# EAGLE design PFC_Method_V1.1 (EAGLE 9.3.0)
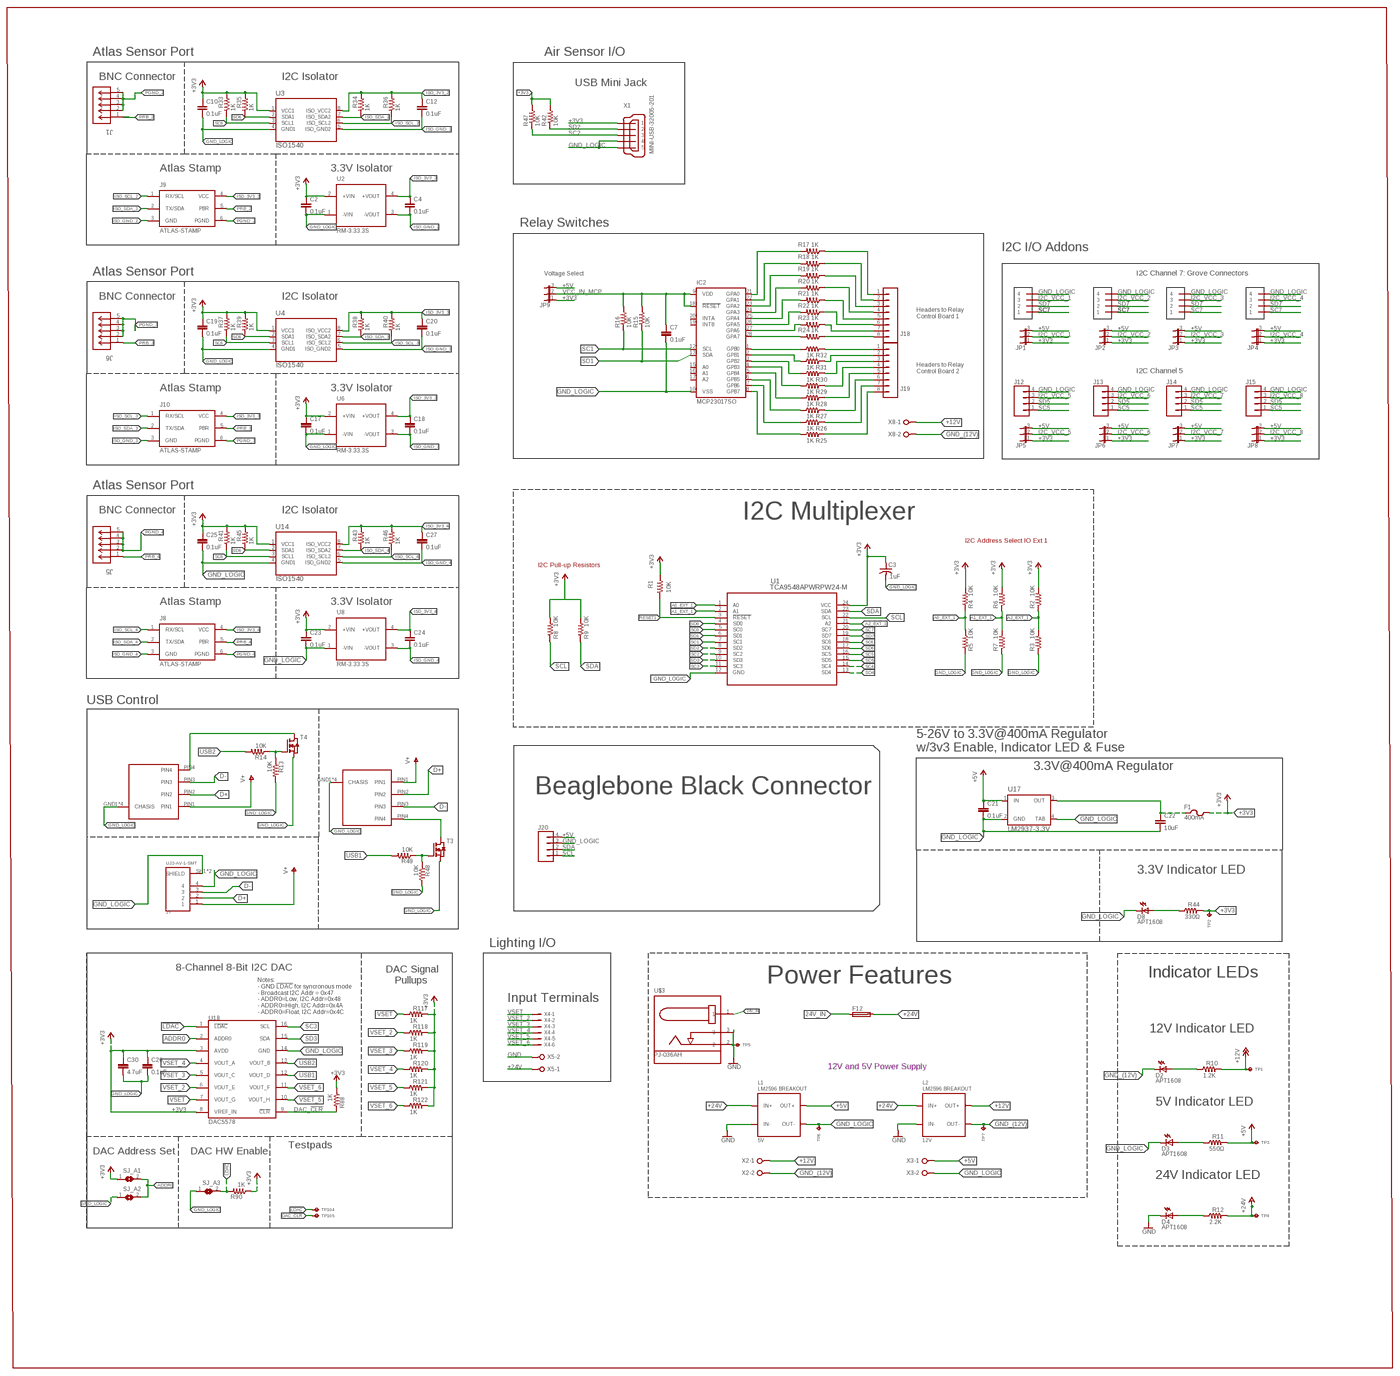
[diagram p0: schematic, sheet 1, overview]
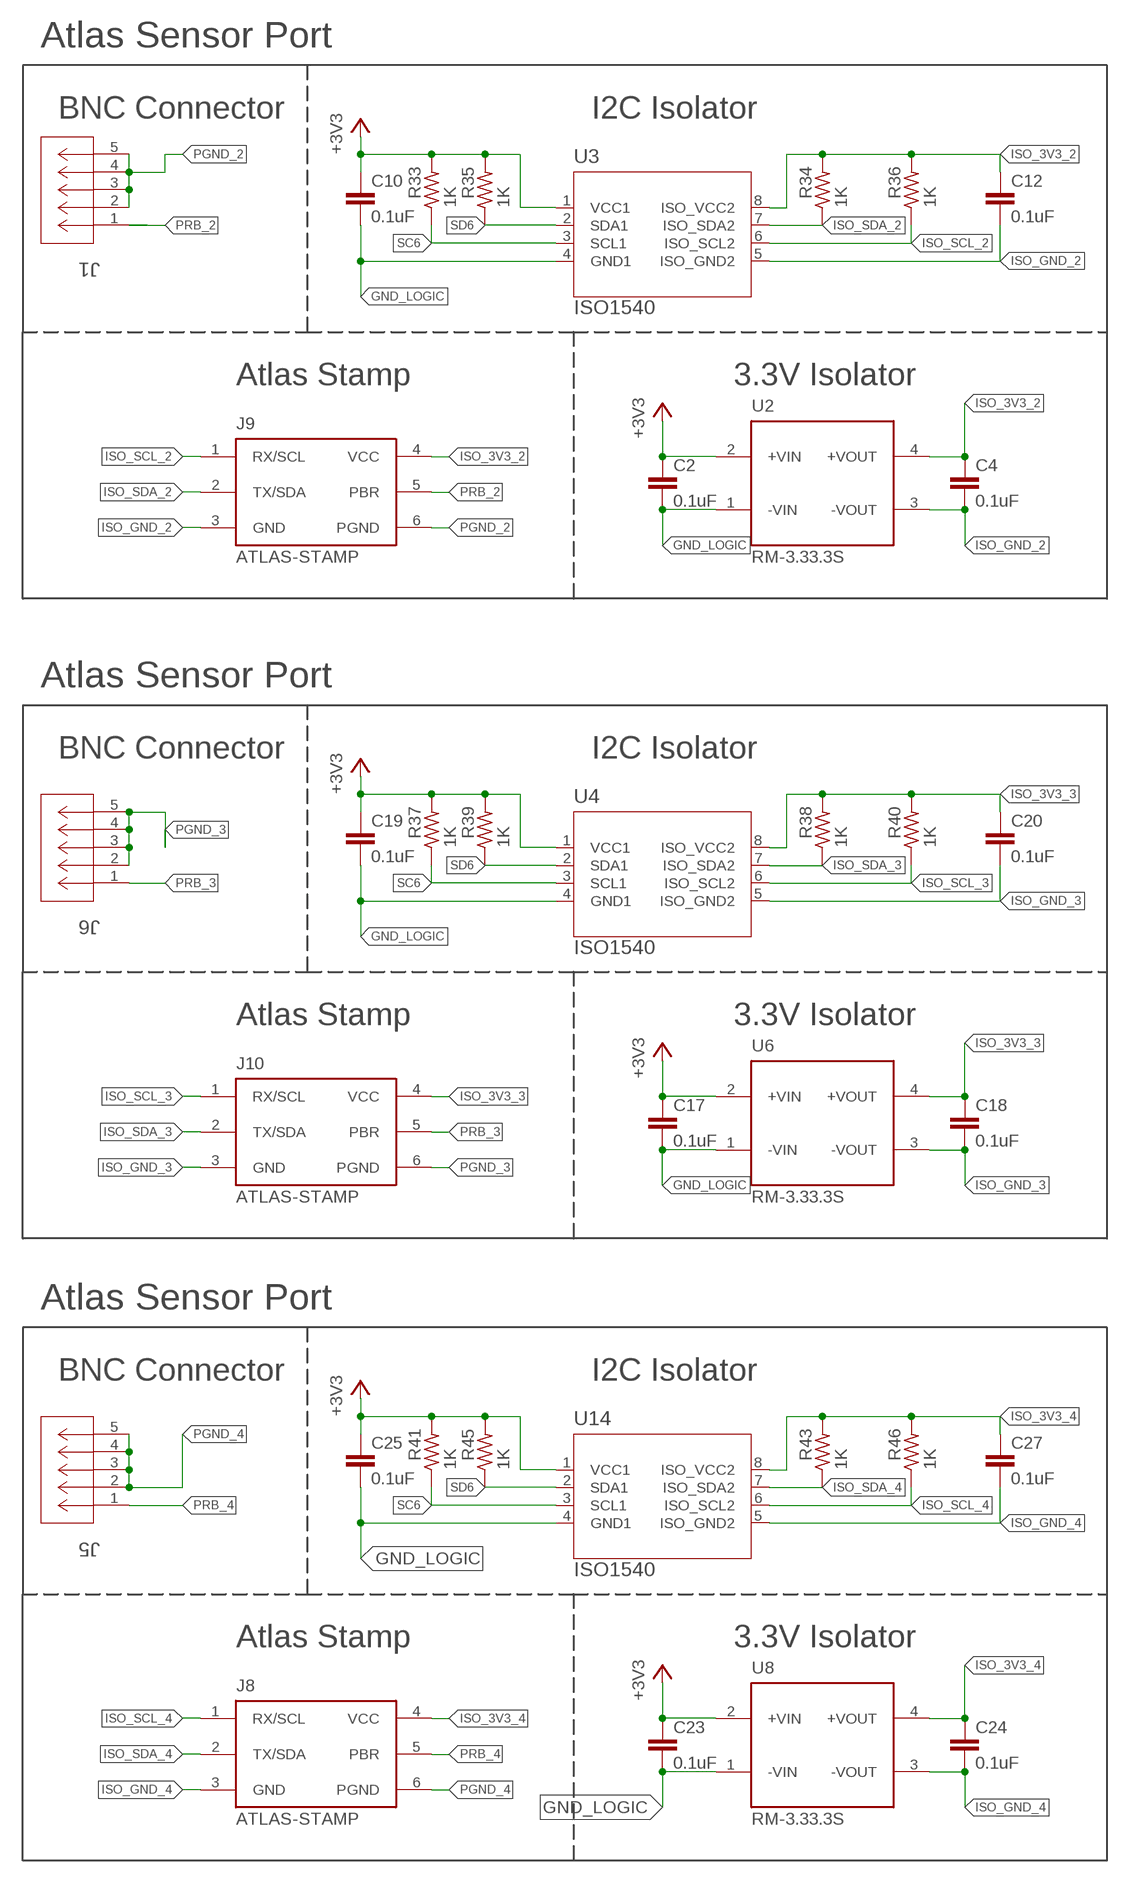
[diagram p1: schematic, sheet 1, part 1 of 4]
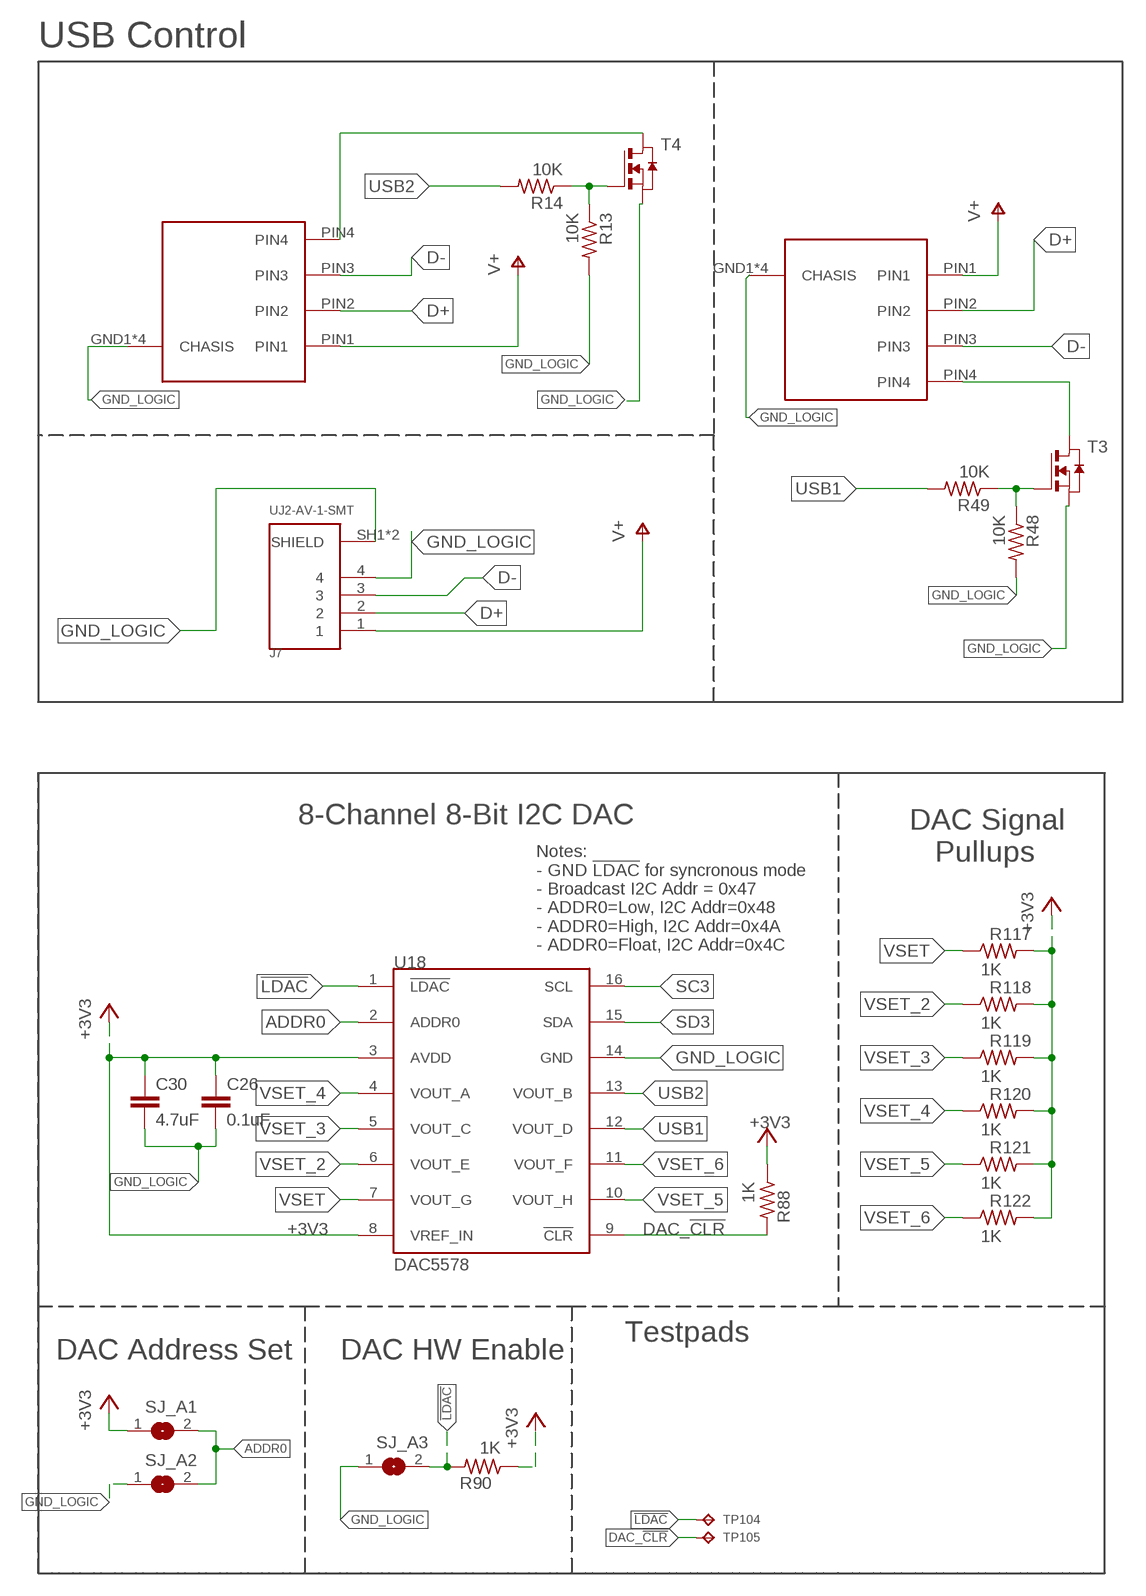
[diagram p2: schematic, sheet 1, part 2 of 4]
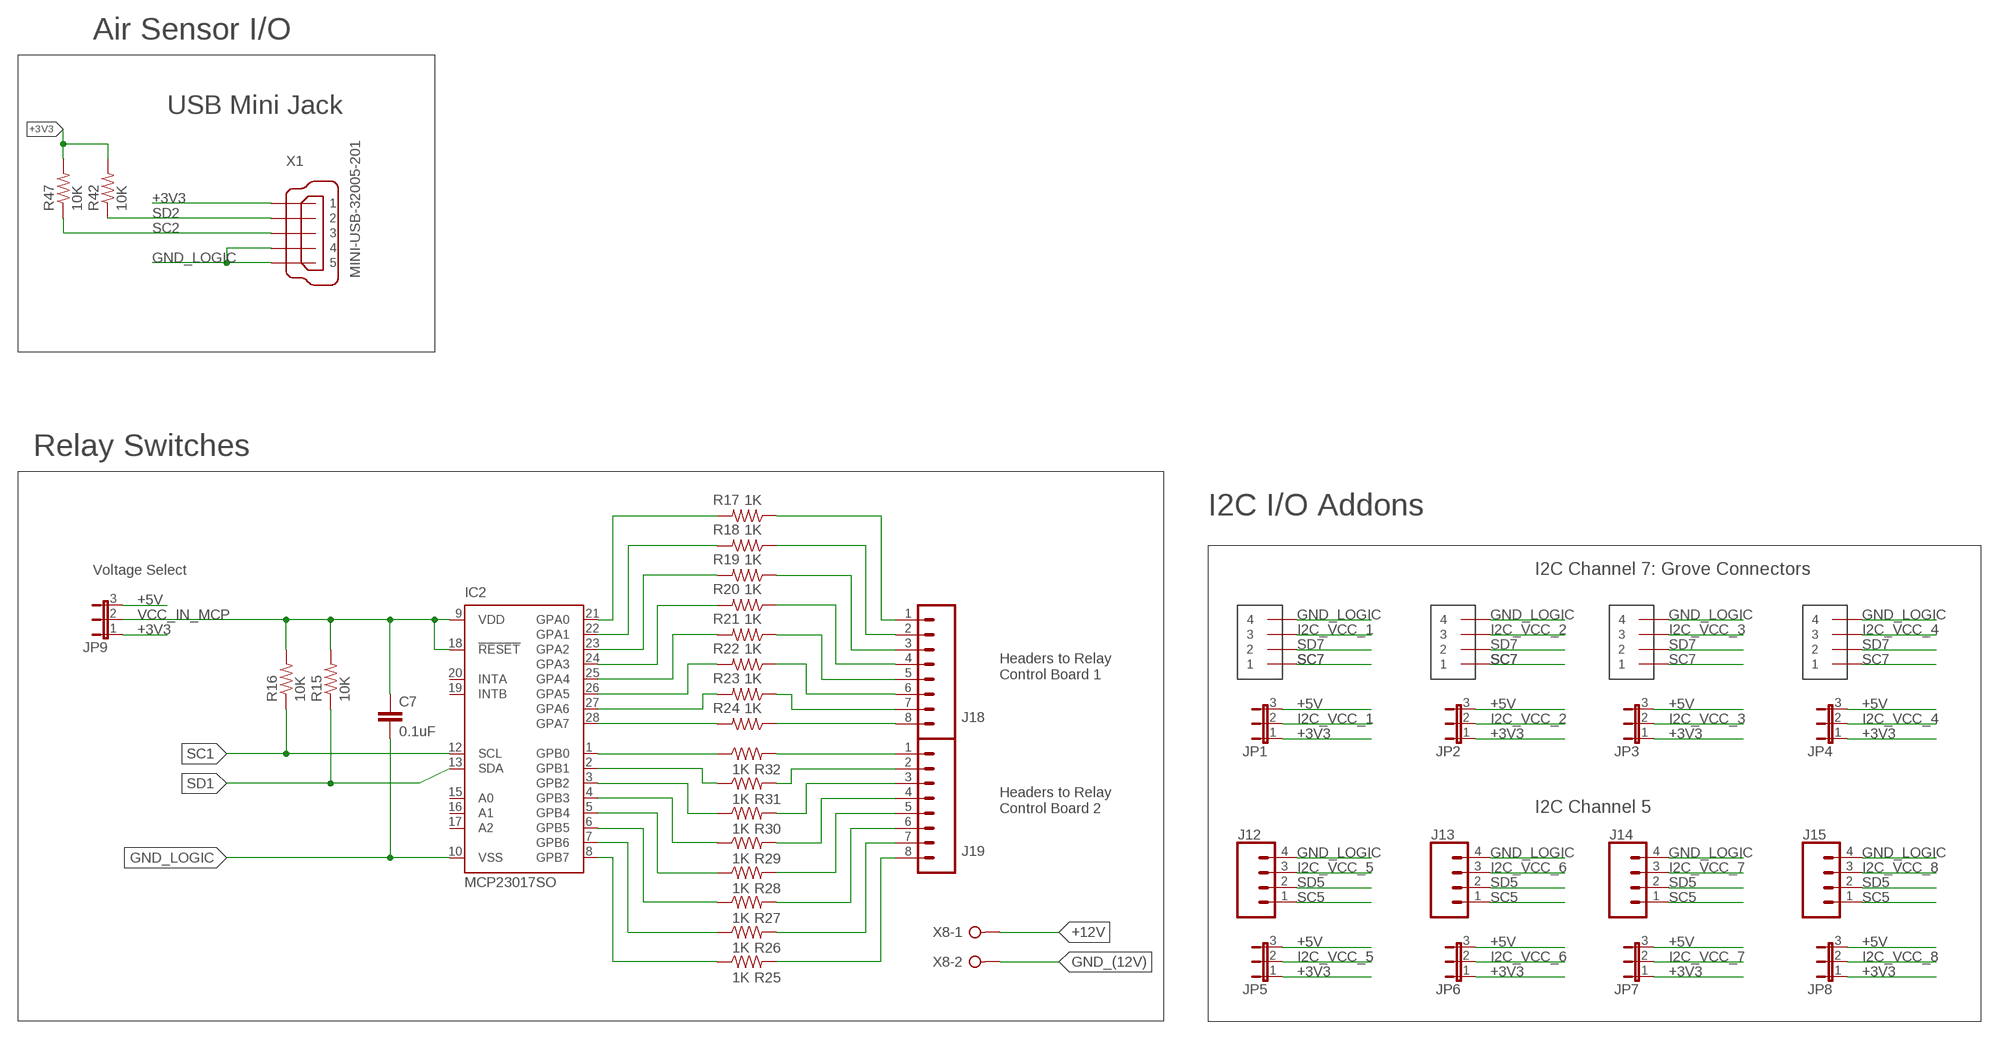
[diagram p3: schematic, sheet 1, part 3 of 4]
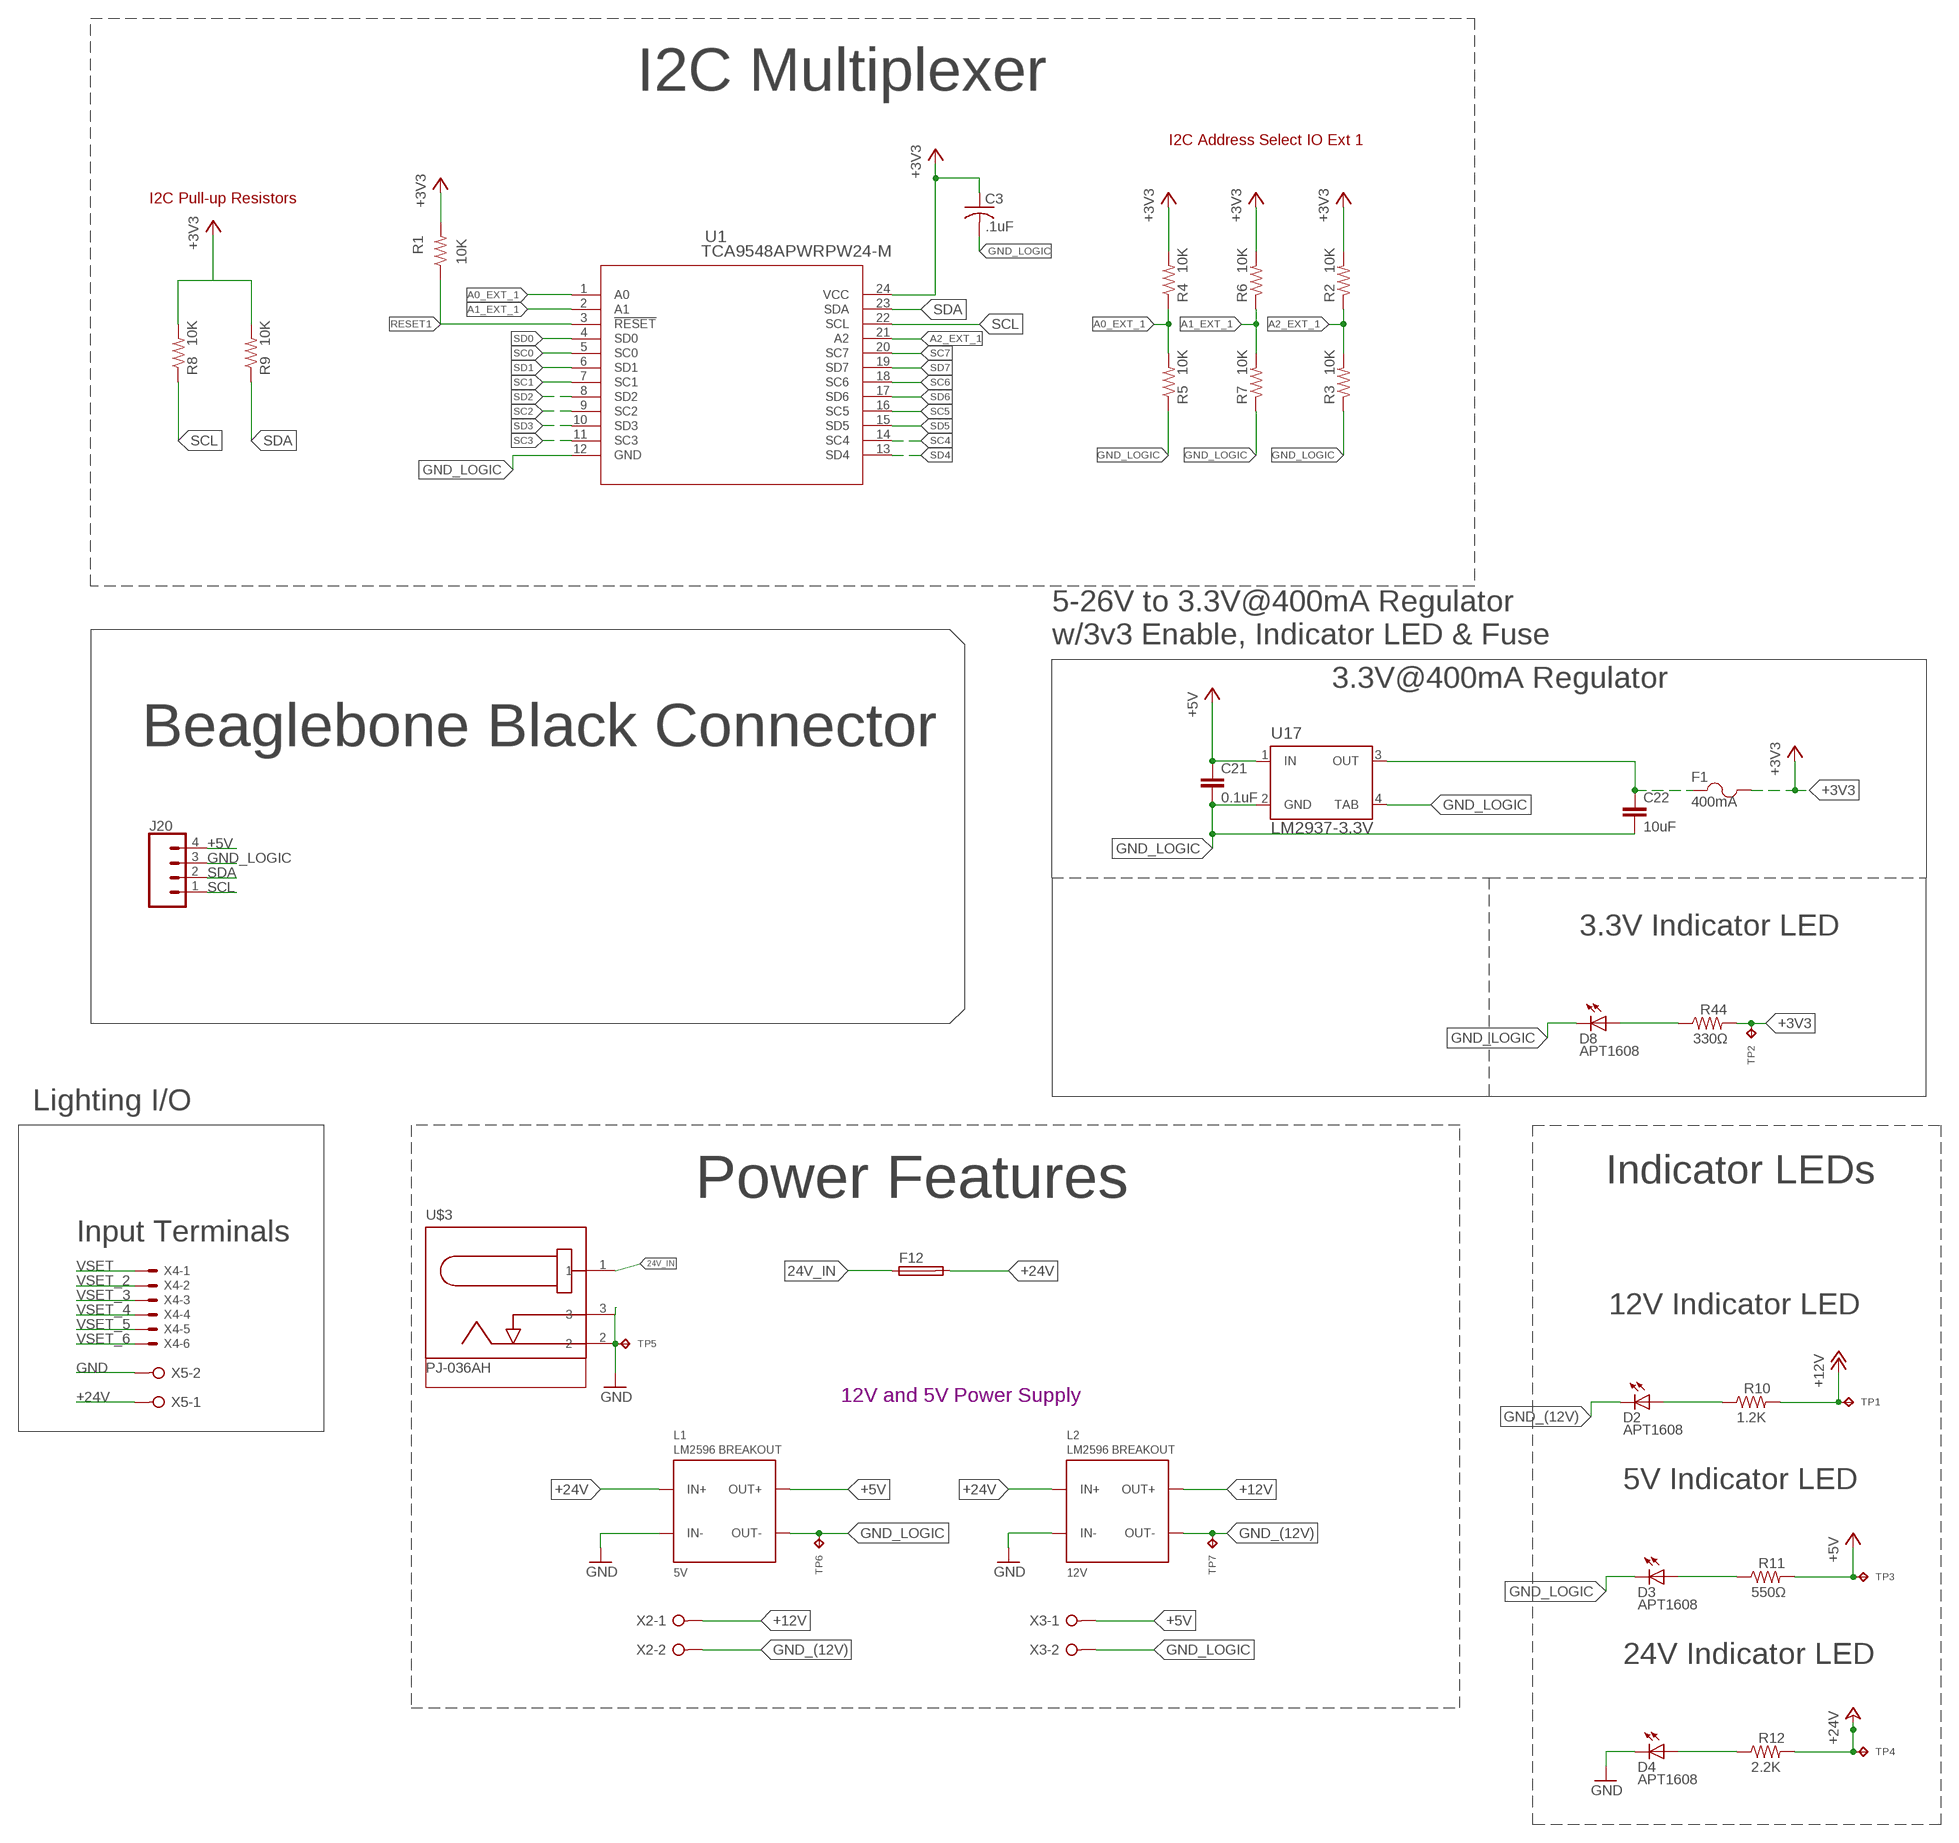
[diagram p4: schematic, sheet 1, part 4 of 4]

## Parts
C2  0.1uF  0.1UF-C0603C104K5RACTU  [C0603]
C3  .1uF  C-USC0603  [C0603@1]
C4  0.1uF  0.1UF-C0603C104K5RACTU  [C0603]
C7  0.1uF  0.1UF-C0603C104K5RACTU  [C0603]
C10  0.1uF  0.1UF-C0603C104K5RACTU  [C0603]
C12  0.1uF  0.1UF-C0603C104K5RACTU  [C0603]
C17  0.1uF  0.1UF-C0603C104K5RACTU  [C0603]
C18  0.1uF  0.1UF-C0603C104K5RACTU  [C0603]
C19  0.1uF  0.1UF-C0603C104K5RACTU  [C0603]
C20  0.1uF  0.1UF-C0603C104K5RACTU  [C0603]
C21  0.1uF  0.1UF-C0603C104K5RACTU  [C0603]
C22  10uF  10UF-GMK212BBJ106KG-T  [C0805]
C23  0.1uF  0.1UF-C0603C104K5RACTU  [C0603]
C24  0.1uF  0.1UF-C0603C104K5RACTU  [C0603]
C25  0.1uF  0.1UF-C0603C104K5RACTU  [C0603]
C26  0.1uF  0.1UF-C0603C104K5RACTU  [C0603]
C27  0.1uF  0.1UF-C0603C104K5RACTU  [C0603]
C30  4.7uF  4.7UF-CL21A475KBQNNNE  [C0805]
D2  APT1608  APT1608CGCK  [CHIPLED_0603]
D3  APT1608  APT1608CGCK  [CHIPLED_0603]
D4  APT1608  APT1608CGCK  [CHIPLED_0603]
D8  APT1608  APT1608CGCK  [CHIPLED_0603]
F1  400mA  0438.375WR  [0603]
F12  GSH15  [GSH15]
IC2  MCP23017SO  [SO28W]
J1  5-1634503-1  [CONN5_5-1634503-1]
J2  GROVE_4PIN_CONNECTOR  [GROVE_4PIN_CONNECTOR]
J3  GROVE_4PIN_CONNECTOR  [GROVE_4PIN_CONNECTOR]
J5  5-1634503-1  [CONN5_5-1634503-1]
J6  5-1634503-1  [CONN5_5-1634503-1]
J7  UJ2-AV-1-SMT  [CUI_UJ2-AV-1-SMT]
J8  ATLAS-STAMP  [ATLAS-STAMP]
J9  ATLAS-STAMP  [ATLAS-STAMP]
J10  ATLAS-STAMP  [ATLAS-STAMP]
J12  CONN_04  [1X04]
J13  CONN_04  [1X04]
J14  CONN_04  [1X04]
J15  CONN_04  [1X04]
J16  GROVE_4PIN_CONNECTOR  [GROVE_4PIN_CONNECTOR]
J17  GROVE_4PIN_CONNECTOR  [GROVE_4PIN_CONNECTOR]
J18  CONN_08"  [1X08]
J19  CONN_08"  [1X08]
J20  CONN_04  [1X04]
JP1  JP2E  [JP2]
JP2  JP2E  [JP2]
JP3  JP2E  [JP2]
JP4  JP2E  [JP2]
JP5  JP2E  [JP2]
JP6  JP2E  [JP2]
JP7  JP2E  [JP2]
JP8  JP2E  [JP2]
JP9  JP2E  [JP2]
L1  5V  LM2596_BREAKOUT  [LM2596]
L2  12V  LM2596_BREAKOUT  [LM2596]
R1  10K  R-US_R0603  [R0603]
R2  10K  10KOHM-1/10W-1%(0603)0603  [0603-RES]
R3  10K  10KOHM-1/10W-1%(0603)0603  [0603-RES]
R4  10K  10KOHM-1/10W-1%(0603)0603  [0603-RES]
R5  10K  10KOHM-1/10W-1%(0603)0603  [0603-RES]
R6  10K  10KOHM-1/10W-1%(0603)0603  [0603-RES]
R7  10K  10KOHM-1/10W-1%(0603)0603  [0603-RES]
R8  10K  10KOHM-1/10W-1%(0603)0603  [0603-RES]
R9  10K  10KOHM-1/10W-1%(0603)0603  [0603-RES]
R10  1.2K  100OHM-RC0603JR-07100RL  [RC0603N]
R11  550Ω  100OHM-RC0603JR-07100RL  [RC0603N]
R12  2.2K  100OHM-RC0603JR-07100RL  [RC0603N]
R13  10K  R-US_R0805W  [R0805W]
R14  10K  R-US_R0805W  [R0805W]
R15  10K  R-US_R0603  [R0603]
R16  10K  R-US_R0603  [R0603]
R17  1K  1K-ERJ-PB3D1001V  [RC0603N]
R18  1K  1K-ERJ-PB3D1001V  [RC0603N]
R19  1K  1K-ERJ-PB3D1001V  [RC0603N]
R20  1K  1K-ERJ-PB3D1001V  [RC0603N]
R21  1K  1K-ERJ-PB3D1001V  [RC0603N]
R22  1K  1K-ERJ-PB3D1001V  [RC0603N]
R23  1K  1K-ERJ-PB3D1001V  [RC0603N]
R24  1K  1K-ERJ-PB3D1001V  [RC0603N]
R25  1K  1K-ERJ-PB3D1001V  [RC0603N]
R26  1K  1K-ERJ-PB3D1001V  [RC0603N]
R27  1K  1K-ERJ-PB3D1001V  [RC0603N]
R28  1K  1K-ERJ-PB3D1001V  [RC0603N]
R29  1K  1K-ERJ-PB3D1001V  [RC0603N]
R30  1K  1K-ERJ-PB3D1001V  [RC0603N]
R31  1K  1K-ERJ-PB3D1001V  [RC0603N]
R32  1K  1K-ERJ-PB3D1001V  [RC0603N]
R33  1K  1K-ERJ-PB3D1001V  [RC0603N]
R34  1K  1K-ERJ-PB3D1001V  [RC0603N]
R35  1K  1K-ERJ-PB3D1001V  [RC0603N]
R36  1K  1K-ERJ-PB3D1001V  [RC0603N]
R37  1K  1K-ERJ-PB3D1001V  [RC0603N]
R38  1K  1K-ERJ-PB3D1001V  [RC0603N]
R39  1K  1K-ERJ-PB3D1001V  [RC0603N]
R40  1K  1K-ERJ-PB3D1001V  [RC0603N]
R41  1K  1K-ERJ-PB3D1001V  [RC0603N]
R42  10K  R-US_R0603  [R0603]
R43  1K  1K-ERJ-PB3D1001V  [RC0603N]
R44  330Ω  100OHM-RC0603JR-07100RL  [RC0603N]
R45  1K  1K-ERJ-PB3D1001V  [RC0603N]
R46  1K  1K-ERJ-PB3D1001V  [RC0603N]
R47  10K  R-US_R0603  [R0603]
R48  10K  R-US_R0805W  [R0805W]
R49  10K  R-US_R0805W  [R0805W]
R88  1K  1K-ERJ-PB3D1001V  [RC0603N]
R90  1K  1K-ERJ-PB3D1001V  [RC0603N]
R117  1K  1K-ERJ-PB3D1001V  [RC0603N]
R118  1K  1K-ERJ-PB3D1001V  [RC0603N]
R119  1K  1K-ERJ-PB3D1001V  [RC0603N]
R120  1K  1K-ERJ-PB3D1001V  [RC0603N]
R121  1K  1K-ERJ-PB3D1001V  [RC0603N]
R122  1K  1K-ERJ-PB3D1001V  [RC0603N]
SJ_A1  SOLDERJUMPERREFLOW_NOPASTE  [SJ1]
SJ_A2  SOLDERJUMPERREFLOW_NOPASTE  [SJ1]
SJ_A3  SOLDERJUMPERREFLOW_NOPASTE  [SJ1]
T3  NMOSSOT23  [SOT-23]
T4  NMOSSOT23  [SOT-23]
TP1  TPTP04R  [TP04R]
TP2  TPTP06R  [TP06R]
TP3  TPTP04R  [TP04R]
TP4  TPTP04R  [TP04R]
TP5  TPTP04R  [TP04R]
TP6  TPTP04R  [TP04R]
TP7  TPTP04R  [TP04R]
TP104  TPTP04R  [TP04R]
TP105  TPTP04R  [TP04R]
U1  TCA9548APWRPW24-M  [PW24-M]
U2  RM-3.33.3S  RM3.33.3S  [RM3.33.3S-SIP4]
U3  ISO1540  ISO1540DR  [D8]
U4  ISO1540  ISO1540DR  [D8]
U6  RM-3.33.3S  RM3.33.3S  [RM3.33.3S-SIP4]
U8  RM-3.33.3S  RM3.33.3S  [RM3.33.3S-SIP4]
U14  ISO1540  ISO1540DR  [D8]
U17  LM2937-3.3V  LM2937IMP-3.3/NOPB  [MP04A]
U18  DAC5578  DAC5578SPW  [TSSOP16]
U$3  PJ-036AH  BARREL-JACK-PJ-036AH-SMT-TR  [BARREL-JACK-PJ-036AH]
U$5  USB_RIGHT  [USB_RIGHT]
U$6  USB_RIGHT  [USB_RIGHT]
X1  MINI-USB-32005-201  [32005-201]
X2  W237-02P  [W237-132]
X3  W237-02P  [W237-132]
X4  22-23-2061  [22-23-2061]
X5  W237-02P  [W237-132]
X8  W237-02P  [W237-132]

## Nets
24V_IN: F12.1 U$3.1
!LDAC!: R90.2 SJ_A3.2 TP104.1(TP) U18.1(!LDAC!)
+3V3: C2.1 C3.1 C10.1 C17.1 C19.1 C23.1 C25.1 C26.1 C30.1 F1.2 JP1.1 JP2.1 JP3.1 JP4.1 JP5.1 JP6.1 JP7.1 JP8.1 JP9.1 R1.2 R2.2 R4.2 R6.2 R8.2 R9.2 R33.2 R35.2 R37.2 R39.2 R41.2 R42.2 R44.2 R45.2 R47.2 R88.1 R90.1 R117.2 R118.2 R119.2 R120.2 R121.2 R122.2 SJ_A1.1 TP2.TP U1.24(VCC) U2.2(+VIN) U3.1(VCC1) U4.1(VCC1) U6.2(+VIN) U8.2(+VIN) U14.1(VCC1) U18.3(AVDD) U18.8(VREF_IN) X1.1
+5V: C21.1 J20.4 JP1.3 JP2.3 JP3.3 JP4.3 JP5.3 JP6.3 JP7.3 JP8.3 JP9.3 L1.OUT+ R11.2 TP3.1(TP) U17.1(IN) X3.1
+12V: L2.OUT+ R10.2 TP1.1(TP) X2.1 X8.1
+24V: F12.2 L1.IN+ L2.IN+ R12.2 TP4.1(TP) X5.1
A0_EXT_1: R4.1 R5.2 U1.1(A0)
A1_EXT_1: R6.1 R7.2 U1.2(A1)
A2_EXT_1: R2.1 R3.2 U1.21(A2)
ADDR0: SJ_A1.2 SJ_A2.2 U18.2(ADDR0)
D+: J7.2 U$5.PIN2 U$6.PIN2
D-: J7.3 U$5.PIN3 U$6.PIN3
DAC_!CLR!: R88.2 TP105.1(TP) U18.9(!CLR!)
GND: D4.C L1.IN- L2.IN- TP5.1(TP) U$3.2 U$3.3 X5.2
GND_(12V): D2.C L2.OUT- TP7.1(TP) X2.2 X8.2
GND_LOGIC: C2.2 C3.2 C7.2 C10.2 C17.2 C19.2 C21.2 C22.2 C23.2 C25.2 C26.2 C30.2 D3.C D8.C IC2.10(VSS) J2.P$4 J3.P$4 J7.4 J7.SH1(SHIELD) J7.SH2(SHIELD) J12.4 J13.4 J14.4 J15.4 J16.P$4 J17.P$4 J20.3 L1.OUT- R3.1 R5.1 R7.1 R13.2 R48.2 SJ_A2.1 SJ_A3.1 T3.2(S) T4.2(S) TP6.1(TP) U1.12(GND) U2.1(-VIN) U3.4(GND1) U4.4(GND1) U6.1(-VIN) U8.1(-VIN) U14.4(GND1) U17.2(GND) U17.4(TAB) U18.14(GND) U$5.GND1(CHASIS) U$5.GND2(CHASIS) U$5.GND3(CHASIS) U$5.GND4(CHASIS) U$6.GND1(CHASIS) U$6.GND2(CHASIS) U$6.GND3(CHASIS) U$6.GND4(CHASIS) X1.4 X1.5 X3.2
I2C_VCC_1: J16.P$3 JP1.2
I2C_VCC_2: J17.P$3 JP2.2
I2C_VCC_3: J2.P$3 JP3.2
I2C_VCC_4: J3.P$3 JP4.2
I2C_VCC_5: J12.3 JP5.2
I2C_VCC_6: J13.3 JP6.2
I2C_VCC_7: J14.3 JP7.2
I2C_VCC_8: J15.3 JP8.2
ISO_3V3_2: C4.1 C12.1 J9.4(VCC) R34.2 R36.2 U2.4(+VOUT) U3.8(ISO_VCC2)
ISO_3V3_3: C18.1 C20.1 J10.4(VCC) R38.2 R40.2 U4.8(ISO_VCC2) U6.4(+VOUT)
ISO_3V3_4: C24.1 C27.1 J8.4(VCC) R43.2 R46.2 U8.4(+VOUT) U14.8(ISO_VCC2)
ISO_GND_2: C4.2 C12.2 J9.3(GND) U2.3(-VOUT) U3.5(ISO_GND2)
ISO_GND_3: C18.2 C20.2 J10.3(GND) U4.5(ISO_GND2) U6.3(-VOUT)
ISO_GND_4: C24.2 C27.2 J8.3(GND) U8.3(-VOUT) U14.5(ISO_GND2)
ISO_SCL_2: J9.1(RX/SCL) R36.1 U3.6(ISO_SCL2)
ISO_SCL_3: J10.1(RX/SCL) R40.1 U4.6(ISO_SCL2)
ISO_SCL_4: J8.1(RX/SCL) R46.1 U14.6(ISO_SCL2)
ISO_SDA_2: J9.2(TX/SDA) R34.1 U3.7(ISO_SDA2)
ISO_SDA_3: J10.2(TX/SDA) R38.1 U4.7(ISO_SDA2)
ISO_SDA_4: J8.2(TX/SDA) R43.1 U14.7(ISO_SDA2)
N$1: R13.1 R14.1 T4.3(G)
N$2: D3.A R11.1
N$3: R48.1 R49.1 T3.3(G)
N$4: D4.A R12.1
N$5: T3.1(D) U$6.PIN4
N$6: IC2.21(GPA0) R17.2
N$7: IC2.22(GPA1) R18.2
N$8: T4.1(D) U$5.PIN4
N$9: IC2.23(GPA2) R19.2
N$10: IC2.24(GPA3) R20.2
N$11: IC2.25(GPA4) R21.2
N$12: D2.A R10.1
N$13: IC2.26(GPA5) R22.2
N$14: IC2.27(GPA6) R23.2
N$15: IC2.28(GPA7) R24.2
N$16: J18.1 R17.1
N$17: J18.2 R18.1
N$18: J18.3 R19.1
N$19: J18.4 R20.1
N$20: J18.5 R21.1
N$21: J18.6 R22.1
N$22: J18.7 R23.1
N$23: J18.8 R24.1
N$24: J19.8 R25.2
N$25: J19.7 R26.2
N$26: J19.6 R27.2
N$27: J19.5 R28.2
N$28: J19.4 R29.2
N$29: J19.3 R30.2
N$30: J19.2 R31.2
N$31: J19.1 R32.2
N$32: IC2.8(GPB7) R25.1
N$33: IC2.7(GPB6) R26.1
N$34: IC2.6(GPB5) R27.1
N$35: IC2.5(GPB4) R28.1
N$36: IC2.4(GPB3) R29.1
N$37: IC2.3(GPB2) R30.1
N$38: IC2.2(GPB1) R31.1
N$39: IC2.1(GPB0) R32.1
N$179: D8.A R44.1
N$180: C22.1 F1.1 U17.3(OUT)
PGND_2: J1.2 J1.3 J1.4 J1.5 J9.6(PGND)
PGND_3: J6.2 J6.3 J6.4 J6.5 J10.6(PGND)
PGND_4: J5.2 J5.3 J5.4 J5.5 J8.6(PGND)
PRB_2: J1.1 J9.5(PBR)
PRB_3: J6.1 J10.5(PBR)
PRB_4: J5.1 J8.5(PBR)
RESET1: R1.1 U1.3(!RESET)
SC0: U1.5(SC0)
SC1: IC2.12(SCL) R16.1 U1.7(SC1)
SC2: R47.1 U1.9(SC2) X1.3
SC3: U1.11(SC3) U18.16(SCL)
SC4: U1.14(SC4)
SC5: J12.1 J13.1 J14.1 J15.1 U1.16(SC5)
SC6: R33.1 R37.1 R41.1 U1.18(SC6) U3.3(SCL1) U4.3(SCL1) U14.3(SCL1)
SC7: J2.P$1 J3.P$1 J16.P$1 J17.P$1 U1.20(SC7)
SCL: J20.1 R8.1 U1.22(SCL)
SD0: U1.4(SD0)
SD1: IC2.13(SDA) R15.1 U1.6(SD1)
SD2: R42.1 U1.8(SD2) X1.2
SD3: U1.10(SD3) U18.15(SDA)
SD4: U1.13(SD4)
SD5: J12.2 J13.2 J14.2 J15.2 U1.15(SD5)
SD6: R35.1 R39.1 R45.1 U1.17(SD6) U3.2(SDA1) U4.2(SDA1) U14.2(SDA1)
SD7: J2.P$2 J3.P$2 J16.P$2 J17.P$2 U1.19(SD7)
SDA: J20.2 R9.1 U1.23(SDA)
USB1: R49.2 U18.12(VOUT_D)
USB2: R14.2 U18.13(VOUT_B)
V+: J7.1 U$5.PIN1 U$6.PIN1
VCC_IN_MCP: C7.1 IC2.9(VDD) IC2.18(!RESET) JP9.2 R15.2 R16.2
VSET: R117.1 U18.7(VOUT_G) X4.1
VSET_2: R118.1 U18.6(VOUT_E) X4.2
VSET_3: R119.1 U18.5(VOUT_C) X4.3
VSET_4: R120.1 U18.4(VOUT_A) X4.4
VSET_5: R121.1 U18.10(VOUT_H) X4.5
VSET_6: R122.1 U18.11(VOUT_F) X4.6
Unconnected: IC2.15(A0) IC2.16(A1) IC2.17(A2) IC2.19(INTB) IC2.20(INTA)

## Notes on the sheet
- Atlas Sensor Port | Air Sensor I/O
- BNC Connector | I2C Isolator
- USB Mini Jack
- Atlas Stamp | 3.3V Isolator
- Relay Switches
- I2C I/O Addons
- Atlas Sensor Port | Voltage Select | I2C Channel 7: Grove Connectors
- BNC Connector | I2C Isolator
- Headers to Relay 
  Control Board 1
- Headers to Relay 
  Control Board 2
- I2C Channel 5
- Atlas Stamp | 3.3V Isolator
- Atlas Sensor Port
- BNC Connector | I2C Isolator
- I2C Multiplexer
- I2C Address Select IO Ext 1
- I2C Pull-up Resistors
- Atlas Stamp | 3.3V Isolator
- USB Control
- 5-26V to 3.3V@400mA Regulator 
  w/3v3 Enable, Indicator LED & Fuse
- 3.3V@400mA Regulator
- Beaglebone Black Connector
- 3.3V Indicator LED
- Lighting I/O
- 8-Channel 8-Bit I2C DAC
- Indicator LEDs
- DAC Signal 
     Pullups
- Power Features
- Input Terminals
- Notes:
  - GND !LDAC! for syncronous mode
  - Broadcast I2C Addr = 0x47
  - ADDR0=Low, I2C Addr=0x48
  - ADDR0=High, I2C Addr=0x4A
  - ADDR0=Float, I2C Addr=0x4C
- 12V Indicator LED
- 12V and 5V Power Supply
- 5V Indicator LED
- Testpads
- DAC Address Set | DAC HW Enable
- 24V Indicator LED

## Library data of the parts
C2 C4 C7 C10 C12 C17-C21 C23-C27 = openag-capacitors:0.1UF-C0603C104K5RACTU: CAP CER 0.1UF 50V X7R 0603 Description: 0.1µF ±10% 50V Ceramic Capacitor X7R 0603 (1608 Metric) Technical Specifications: Capacitance: 0.1µF Tolerance: ±10% Rated Voltage: 50V Temperature Coefficient: X7R Operating Temperature: -55°C ~ 125°C Package / Case: 0603 (1608 Metric) Datasheet(s): X7R Dielectric, 6.3-250 VDC <https://search.kemet.com/component-edge/download/datasheet/C0603C104K5RACTU.pdf> Vendor(s): Digikey: 399-5089-1-ND <https://www.digikey.com/product-detail/en/kemet/C0603C104K5RACTU/399-5089-1-ND/1465623>; MANUFACTURER: Kemet; MPN: C0603C104K5RACTU; VENDOR: Digikey; VLINK: https://www.digikey.com/product-detail/en/kemet/C0603C104K5RACTU/399-5089-1-ND/1465623; VPN: 399-5089-1-ND
C3 = rcl:C-US: CAPACITOR, American symbol
C22 = openag-capacitors:10UF-GMK212BBJ106KG-T: CAP CER 10UF 35V X5R 0805 Description: 10µF ±10% 35V Ceramic Capacitor X5R 0805 (2012 Metric) Technical Specifications: Capacitance: 10µF Tolerance: ±10% Rated Voltage: 35V Temperature Coefficient: X5R Operating Temperature: -55°C ~ 85°C Package / Case: 0805 (2012 Metric) Datasheet(s): GMK212BBJ106KG-T Spec <http://ds.yuden.co.jp/TYCOMPAS/ut/detail.do?productNo=GMK212BBJ106KG-T&fileName=GMK212BBJ106KG-T_SS&mode=specSheetDownload> Vendor(s): Digikey: 587-4893-1-ND <https://www.digikey.com/product-detail/en/taiyo-yuden/GMK212BBJ106KG-T/587-4893-1-ND/6563736>; MANUFACTURER: Taiyo Yuden; MPN: GMK212BBJ106KG-T; VENDOR: Digikey; VLINK: https://www.digikey.com/product-detail/en/taiyo-yuden/GMK212BBJ106KG-T/587-4893-1-ND/6563736; VPN: 587-4893-1-ND
C30 = openag-capacitors:4.7UF-CL21A475KBQNNNE: CAP CER 4.7UF 50V X5R 0805 Description: 4.7µF ±10% 50V Ceramic Capacitor X5R 0805 (2012 Metric) Technical Specifications: Capacitance: 4.7uF Tolerance: ±10% Rated Voltage: 50V Temperature Coefficient: X5R Operating Temperature: -55°C ~ 85°C Package/Case: 0805 (2012 Metric) Datasheet(s): CL21A475KBQNNNE Characteristics <http://www.samsungsem.com/kr/front/downloadcms.do?path=/kr/support/product-search/mlcc/__icsFiles/afieldfile/2014/11/05&fileName=C_CL21A475KBQNNNE.pdf> Vendor(s): Digikey: 1276-1248-1-ND <https://www.digikey.com/product-detail/en/samsung-electro-mechanics/CL21A475KBQNNNE/1276-1248-1-ND/3889334>; MANUFACTURER: Samsung; MPN: CL21A475KBQNNNE; VENDOR: Digikey; VLINK: https://www.digikey.com/product-detail/en/samsung-electro-mechanics/CL21A475KBQNNNE/1276-1248-1-ND/3889334; VPN: 1276-1248-1-ND
D2-D4 D8 = openag-diodes:APT1608CGCK: LED GREEN CLEAR 0603 SMD Description: Green 570nm LED Indication - Discrete 2.1V 0603 (1608 Metric) Technical Specifications: Color: Green Lens Color: Colorless Lens Transparency: Clear Millicandela Rating: 50mcd Lens Style/Size: Rectangle with Flat Top, 1.20mm x 0.80mm Voltage - Forward (Vf) (Typ): 2.1V Current - Test: 20mA Viewing Angle: 120° Mounting Type: Surface Mount Wavelength - Dominant: 570nm Wavelength - Peak: 574nm Package / Case: 0603 (1608 Metric) Supplier Device Package: Chip LED Size / Dimension: 1.60mm L x 0.80mm W Height (Max): 0.75mm Datasheet(s): APT1608CGCK <http://www.kingbrightusa.com/images/catalog/SPEC/APT1608CGCK.pdf> Vendor(s): Digikey: 754-1116-1-ND <https://www.digikey.com/product-detail/en/kingbright/APT1608CGCK/754-1116-1-ND/1747833#>; MANUFACTURER: Kingbright; MPN: APT1608CGCK; VENDOR: Digikey; VLINK: https://www.digikey.com/product-detail/en/kingbright/APT1608CGCK/754-1116-1-ND/1747833#; VPN: 754-1116-1-ND
F1 = openag-fuses:0438.375WR: FUSE BOARD MNT 400MA 125VAC/VDC Description: FUSE BOARD MNT 400MA 125VAC/VDC Technical Specifications: Fuse Type: Board Mount (Cartridge Style Excluded) Current Rating: 400mA Voltage Rating - AC: 125V Voltage Rating - DC: 125V Response Time: Fast Package / Case: 2-SMD, Square End Block Mounting Type: Surface Mount Breaking Capacity @ Rated Voltage: 50A Melting I²t: 0.0416 Approvals: CSA, UL Operating Temperature: -55°C ~ 125°C Size / Dimension: 0.240" L x 0.106" W x 0.106" H (6.10mm x 2.69mm x 2.69mm) DC Cold Resistance: 0.4895 Ohms Datasheet(s): 448 Series Datasheet <http://www.littelfuse.com/~/media/electronics/datasheets/fuses/littelfuse_fuse_448_datasheet.pdf.pdf> Vendor(s): Digikey: F5573CT-ND <https://www.digikey.com/product-detail/en/littelfuse-inc/0448.400MR/F5573CT-ND/3306934>; MANUFACTURER: Littlefuse Inc.; MPN: 0448.400MR; VENDOR: Digikey; VLINK: https://www.digikey.com/product-detail/en/littelfuse-inc/0448.400MR/F5573CT-ND/3306934; VPN: F5573CT-ND
F12 = fuse:GSH15: FUSE HOLDER grid 15mm, 19649 Wickmann; MPN: 64900001039; OC_FARNELL: 1271673; OC_NEWARK: 02P0318
IC2 = microchip:MCP23017: http://ww1.microchip.com/downloads/en/DeviceDoc/21952a.pdf Source: http://ww1.microchip.com/downloads/en/DeviceDoc/21952a.pdf; MF: MICROCHIP; MPN: MCP23017-E/SO; OC_FARNELL: 1332087; OC_NEWARK: 31K2958
J1 J5 J6 = openag-connectors:5-1634503-1; MANUFACTURER_PART_NUMBER: 516345031; VENDOR: TE Connectivity
J2 J3 J16 J17 = Grove_4Pin_Connector:GROVE_4PIN_CONNECTOR
J7 = UJ2-AV-1-SMT:UJ2-AV-1-SMT: 3 µin Plating Thickness, Black Insulator, USB Jack; MANUFACTURER: CUI INC; PART_REV: 1.02; STANDARD: MANFACTURER RECOMMENDATIONS
J8-J10 = openag-connectors:ATLAS-STAMP; MPN: N/A
J12-J15 J20 = SparkFun-Connectors:CONN_04: Multi connection point. Often used as Generic Header-pin footprint for 0.1 inch spaced/style header connections On any of the 0.1 inch spaced packages, you can populate with these: Break Away Headers - Straight <https://www.sparkfun.com/products/116> (PRT-00116) Break Away Male Headers - Right Angle <https://www.sparkfun.com/products/553> (PRT-00553) Female Headers <https://www.sparkfun.com/products/115> (PRT-00115) Break Away Headers - Machine Pin <https://www.sparkfun.com/products/117> (PRT-00117) Break Away Female Headers - Swiss Machine Pin <https://www.sparkfun.com/products/743> (PRT-00743) For SCREWTERMINALS and SPRING TERMINALS visit here: Screw Terimnals on SparkFun.com <https://www.sparkfun.com/search/results?term=Screw+Terminals> (5mm/3.5mm/2.54mm spacing) This device is also useful as a general connection point to wire up your design to another part of your project. Our various solder wires solder well into these plated through hole pads. Hook-Up Wire - Assortment (Stranded, 22 AWG) <https://www.sparkfun.com/products/11375> (PRT-11375) Hook-Up Wire - Assortment (Solid Core, 22 AWG) <https://www.sparkfun.com/products/11367> (PRT-11367) View the entire wire category on our website here <https://www.sparkfun.com/categories/141> Special notes: Molex polarized connector foot print use with SKU : PRT-08231 with associated crimp pins and housings. 1MM SMD Version SKU: PRT-10208; PROD_ID: CONN-09696
J18 J19 = SparkFun-Connectors:CONN_08: Multi connection point. Often used as Generic Header-pin footprint for 0.1 inch spaced/style header connections On any of the 0.1 inch spaced packages, you can populate with these: Break Away Headers - Straight <https://www.sparkfun.com/products/116> (PRT-00116) Break Away Male Headers - Right Angle <https://www.sparkfun.com/products/553> (PRT-00553) Female Headers <https://www.sparkfun.com/products/115> (PRT-00115) Break Away Headers - Machine Pin <https://www.sparkfun.com/products/117> (PRT-00117) Break Away Female Headers - Swiss Machine Pin <https://www.sparkfun.com/products/743> (PRT-00743) Arduino Stackable Header - 8 Pin <https://www.sparkfun.com/products/9279> (PRT-09279) For SCREWTERMINALS and SPRING TERMINALS visit here: Screw Terimnals on SparkFun.com <https://www.sparkfun.com/search/results?term=Screw+Terminals> (5mm/3.5mm/2.54mm spacing) This device is also useful as a general connection point to wire up your design to another part of your project. Our various solder wires solder well into these plated through hole pads. Hook-Up Wire - Assortment (Stranded, 22 AWG) <https://www.sparkfun.com/products/11375> (PRT-11375) Hook-Up Wire - Assortment (Solid Core, 22 AWG) <https://www.sparkfun.com/products/11367> (PRT-11367) View the entire wire category on our website here <https://www.sparkfun.com/categories/141> Special notes: Molex polarized connector foot print use with SKU : PRT-08231 with associated crimp pins and housings. 1MM SMD Version SKU: PRT-10208 NOTES ON THE VARIANTS LOCK and LOCK_LONGPADS... This footprint was designed to help hold the alignment of a through-hole component (i.e. 6-pin header) while soldering it into place. You may notice that each hole has been shifted either up or down by 0.005 of an inch from it's more standard position (which is a perfectly straight line). This slight alteration caused the pins (the squares in the middle) to touch the edges of the holes. Because they are alternating, it causes a "brace" to hold the component in place. 0.005 has proven to be the perfect amount of "off-center" position when using our standard breakaway headers. Although looks a little odd when you look at the bare footprint, once you have a header in there, the alteration is very hard to notice. Also,if you push a header all the way into place, it is covered up entirely on the bottom side.; PROD_ID: CONN-08438
JP1-JP9 = jumper:JP2E: JUMPER
L1 L2 = LM2596 Voltage Regulator Breakout:LM2596_BREAKOUT
R1 R13-R16 R42 R47-R49 = rcl:R-US_: RESISTOR, American symbol; SPICEPREFIX: R
R2-R9 = SparkFun-Resistors:10KOHM-1/10W-1%(0603): RES-00824; PROD_ID: RES-00824
R10-R12 R44 = openag-resistors:100OHM-RC0603JR-07100RL: RES SMD 100 OHM 5% 1/10W 0603 Description: 100 Ohms ±5% 0.1W, 1/10W Chip Resistor 0603 (1608 Metric) Moisture Resistant Thick Film Technical Specifications: Resistance: 100 Ohms Tolerance: ±5% Power (Watts): 0.1W, 1/10W Composition: Thick Film Features: Moisture Resistant Temperature Coefficient: ±100ppm/°C Operating Temperature: -55°C ~ 155°C Package / Case: 0603 (1608 Metric) Supplier Device Package: 0603 Size / Dimension: 0.063" L x 0.032" W (1.60mm x 0.80mm) Height - Seated (Max): 0.022" (0.55mm) Number of Terminations: 2 Datasheet(s): Thick Film Chip Resistor Intro <http://www.yageo.com.tw/exep/pages/download/literatures/PYu-R_INT-thick_7.pdf> Chip Resistor Marking <http://www.yageo.com/exep/pages/download/literatures/PYu-R_Marking_2.pdf> RC Series, L Datasheet <http://www.yageo.com/documents/recent/PYu-RC_Group_51_RoHS_L_8.pdf> Vendor(s): Digikey: 311-100GRCT-ND <https://www.digikey.com/product-detail/en/yageo/RC0603JR-07100RL/311-100GRCT-ND/729644>; MANUFACTURER: Yageo; MPN: RC0603JR-07100RL; VALUE: 100; VENDOR: Digikey; VLINK: https://www.digikey.com/product-detail/en/yageo/RC0603JR-07100RL/311-100GRCT-ND/729644; VPN: 311-100GRCT-ND
R17-R41 R43 R45 R46 R88 R90 R117-R122 = openag-resistors:1K-ERJ-PB3D1001V: RES SMD 1K OHM 0.5% 1/5W 0603 Description: 1 kOhms ±0.5% 0.2W, 1/5W Chip Resistor 0603 (1608 Metric) Automotive AEC-Q200, Pulse Withstanding Thick Film Technical Specifications: Resistance: 1 kOhms Tolerance: ±0.5% Power: 0.2W, 1/5W Operating Temperature: -55°C ~ 155°C Package / Case: 0603 (1608 Metric) Datasheet(s): ERJ-PB3, PB6 Series, High Precision Datasheet <https://industrial.panasonic.com/cdbs/www-data/pdf/RDM0000/AOA0000C328.pdf> Vendor(s): Digikey: P20283CT-ND <https://www.digikey.com/product-detail/en/panasonic-electronic-components/ERJ-PB3D1001V/P20283CT-ND/6214538>; MANUFACTURER: Panasonic; MPN: P20283CT-ND; VENDOR: Digikey; VLINK: https://www.digikey.com/product-detail/en/panasonic-electronic-components/ERJ-PB3D1001V/P20283CT-ND/6214538; VPN: P20283CT-ND
SJ_A1-SJ_A3 = openag-connectors:SOLDERJUMPER: SMD Solder JUMPER Solder the two pads together to create a connection, or remove the solder to break it. REFLOW - Use this footprint for solder paste and reflow ovens. WAVE - Use this footprint for hand-soldering (larger pads). CLOSED - Has a trace between the two pads to ensure it is closed by default. The trace needs to be cut to disable the jumper, and can be closed again by creating a solder bridge between the two pads.; MPN: N/A
T3 T4 = zetex:NMOSSOT23: MOS FET; OC_FARNELL: unknown; OC_NEWARK: unknown
TP1-TP7 TP104 TP105 = openag-testpads:TP: Test pad; MPN: N/A
U1 = OpenAG_I2C:TCA9548APWR; MANUFACTURER_PART_NUMBER: TCA9548APWR; VENDOR: TEXAS INSTRUMENTS
U2 U6 U8 = openag-isolators:RM3.33.3S: CONV DC/DC 0.25W SGL 3.3VOUT SIP Description: Isolated Module DC DC Converter 1 Output 3.3V 76mA 3V - 3.6V Input Technical Specifications: Type: Isolated Module Number of Outputs: 1 Voltage - Input (Min): 3V Voltage - Input (Max): 3.6V Voltage - Output 1: 3.3V Current - Output (Max): 76mA Power (Watts): 250mW Voltage - Isolation: 1kV Applications: ITE (Commercial) Features: SCP Operating Temperature: -40°C ~ 85°C Efficiency: 70% Mounting Type: Through Hole Package / Case: 4-SIP Module Size / Dimension: 0.45" L x 0.24" W x 0.39" H (11.5mm x 6.0mm x 10.0mm) Datasheet(s): RM Series Datasheet <https://www.recom-power.com/pdf/Econoline/RM.pdf> Vendor(s): Digikey: 945-1212-ND <https://www.digikey.com/product-detail/en/recom-power/RM-3.33.3S/945-1212-ND/2256392>; MANUFACTURER: Recom Power; MPN: RM-3.33.3S; VENDOR: Digikey; VLINK: https://www.digikey.com/product-detail/en/recom-power/RM-3.33.3S/945-1212-ND/2256392; VPN: 945-1212-ND
U3 U4 U14 = openag-isolators:ISO1540DR: DGTL ISO 2.5KV 2CH I2C 8SOIC Description: I²C Digital Isolator 2500Vrms 2 Channel 1Mbps 25kV/µs CMTI 8-SOIC (0.154", 3.90mm Width) Technical Specifications: Technology: Capacitive Coupling Type: I²C Number of Channels: 2 Channel Type: Bidirectional Voltage-Isolation: 2500Vrms Voltage - Supply: 3 V ~ 5.5 V Data Rate: 1Mbps Operating Temperature: -40°C ~ 125°C Package / Case: 8-SOIC (0.154", 3.90mm Width) Max Supply Current (3V ≤ VCC1, VCC2 ≤ 3.6V) Side 1, Side 2: 3.8mA, 3.1mA Datasheet(s): ISO154x <http://www.ti.com/lit/ds/symlink/iso1540.pdf> Vendor(s): Digikey: 296-34871-1-ND <https://www.digikey.com/product-detail/en/texas-instruments/ISO1540DR/296-34871-1-ND/3587214>; MANUFACTURER: Texas Instruments; MPN: ISO1540DR; VENDOR: Digikey; VLINK: https://www.digikey.com/product-detail/en/texas-instruments/ISO1540DR/296-34871-1-ND/3587214; VPN: 296-34871-1-ND
U17 = openag-regulators:LM2937IMP-3.3/NOPB: IC REG LIN 3.3V 400MA SOT223-4 Description: Linear Voltage Regulator IC Positive Fixed 1 Output 3.3V 400mA SOT-223-4 Technical Specifications: Output Configuration: Positive Output Type: Fixed Number of Regulators: 1 Voltage - Input (Max): 26V Voltage - Output (Min/Fixed): 3.3V Voltage Dropout (Max): 1V @ 50mA Current - Output: 400mA Current - Quiescent (Iq): 2mA Current - Supply (Max): 1.25A Protection Features: Over Temperature, Reverse Polarity, Short Circuit Operating Temperature: -40°C ~ 85°C Mounting Type: Surface Mount Package / Case: TO-261-4, TO-261AA Supplier Device Package: SOT-223-4 Base Part Number: LM2937 Datasheet(s): LM2937-2.5, LM2937-3.3 Datasheet <http://www.ti.com/lit/ds/symlink/lm2937-2.5.pdf> Vendor(s): Digikey: LM2937IMP-3.3/NOPBCT-ND <https://www.digikey.com/product-detail/en/texas-instruments/LM2937IMP-3.3-NOPB/LM2937IMP-3.3-NOPBCT-ND/270742#>; MANUFACTURER: Texas Instruments; MPN: LM2937IMP-3.3/NOPB; VENDOR: Digikey; VLINK: https://www.digikey.com/product-detail/en/texas-instruments/LM2937IMP-3.3-NOPB/LM2937IMP-3.3-NOPBCT-ND/270742#; VPN: LM2937IMP-3.3/NOPBCT-ND
U18 = openag-dacs:DAC5578SPW: IC DAC 8BIT I2C OCTAL 16TSSOP Description: 8 Bit Digital to Analog Converter 8 16-TSSOP Technical Specifications: Number of Bits: 8 Number of D/A Converters: 8 Settling Time: 12µs (Typ) Output Type: Voltage - Buffered Differential Output: No Data Interface: I²C Reference Type: External Voltage - Supply, Analog: 2.7 V ~ 5.5 V Voltage - Supply, Digital: 2.7 V ~ 5.5 V INL/DNL (LSB): ±0.01, ±0.01 Architecture: String DAC Operating Temperature: -40°C ~ 125°C Package / Case: 16-TSSOP (0.173", 4.40mm Width) Supplier Device Package: 16-TSSOP Base Part Number: DAC5578 Datasheet(s): DAC5578,6578,7578 <http://www.ti.com/lit/ds/symlink/dac5578.pdf> Analog Signal Chain Guide <http://www.ti.com/lit/pdf/slyb174> Vendor(s): Digikey: 296-27736-5-ND <https://www.digikey.com/product-detail/en/texas-instruments/DAC5578SPW/296-27736-5-ND/2360827>; MANUFACTURER: Texas Instruments; MPN: DAC5578SPW; VENDOR: Digikey; VLINK: https://www.digikey.com/product-detail/en/texas-instruments/DAC5578SPW/296-27736-5-ND/2360827; VPN: 296-27736-5-ND
U$3 = openag-connectors:BARREL-JACK-PJ-036AH-SMT-TR: CONN PWR JACK 2X5.5MM SOLDER Description: Power Barrel Connector Jack 2.10mm ID (0.083"), 5.50mm OD (0.217") Surface Mount, Right Angle Technical Specifications: Connector Type: Jack Gender: Male Industry Recognized Mating Diameter: 2.10mm ID (0.083"), 5.50mm OD (0.217") Actual Diameter: 0.078" (2.00mm ID), 0.248" (6.30mm OD) Number of Positions/Contacts: 2 Conductors, 3 Contacts Internal Switch(s): Single Switch, Normally Closed Mounting Type: Surface Mount, Right Angle Termination: Solder Shielding: Unshielded Voltage - Rated: 24VDC Current Rating: 5A Mating Length/Depth: 0.360" (9.15mm) Contact Material - Plating: Silver Operating Temperature: -25°C ~ 85°C Housing Material: Polyamide (PA6T), Nylon 6T Contact Material: Brass; Copper Alloy Body Color: Black Datasheet(s): PJ-036AH-SMT-TR <http://www.cui.com/product/resource/digikeypdf/pj-036ah-smt-tr.pdf> Vendor(s): Digikey: CP-036AHPJCT-ND <https://www.digikey.com/product-detail/en/cui-inc/PJ-036AH-SMT-TR/CP-036AHPJCT-ND/1530994>; MANUFACTURER: CUI Inc.; MPN: PJ-036AH-SMT-TR; VENDOR: Digikey; VLINK: https://www.digikey.com/product-detail/en/cui-inc/PJ-036AH-SMT-TR/CP-036AHPJCT-ND/1530994; VPN: CP-036AHPJCT-ND
U$5 U$6 = openag-connectors:USB_RIGHT
X1 = con-cypressindustries:MINI-USB-: MINI USB-B Conector Source: www.cypressindustries.com; OC_FARNELL: unknown; OC_NEWARK: unknown
X2 X3 X5 X8 = con-wago-508:W237-02P: WAGO SREW CLAMP; OC_FARNELL: unknown; OC_NEWARK: unknown
X4 = con-molex:22-23-2061: .100" (2.54mm) Center Header - 6 Pin; MF: MOLEX; MPN: 22-23-2061; OC_FARNELL: 1462922; OC_NEWARK: 27C1933

## Net classes
0 default: width 0.305 mm, drill 0.254 mm, clearance 0.254 mm

## Board
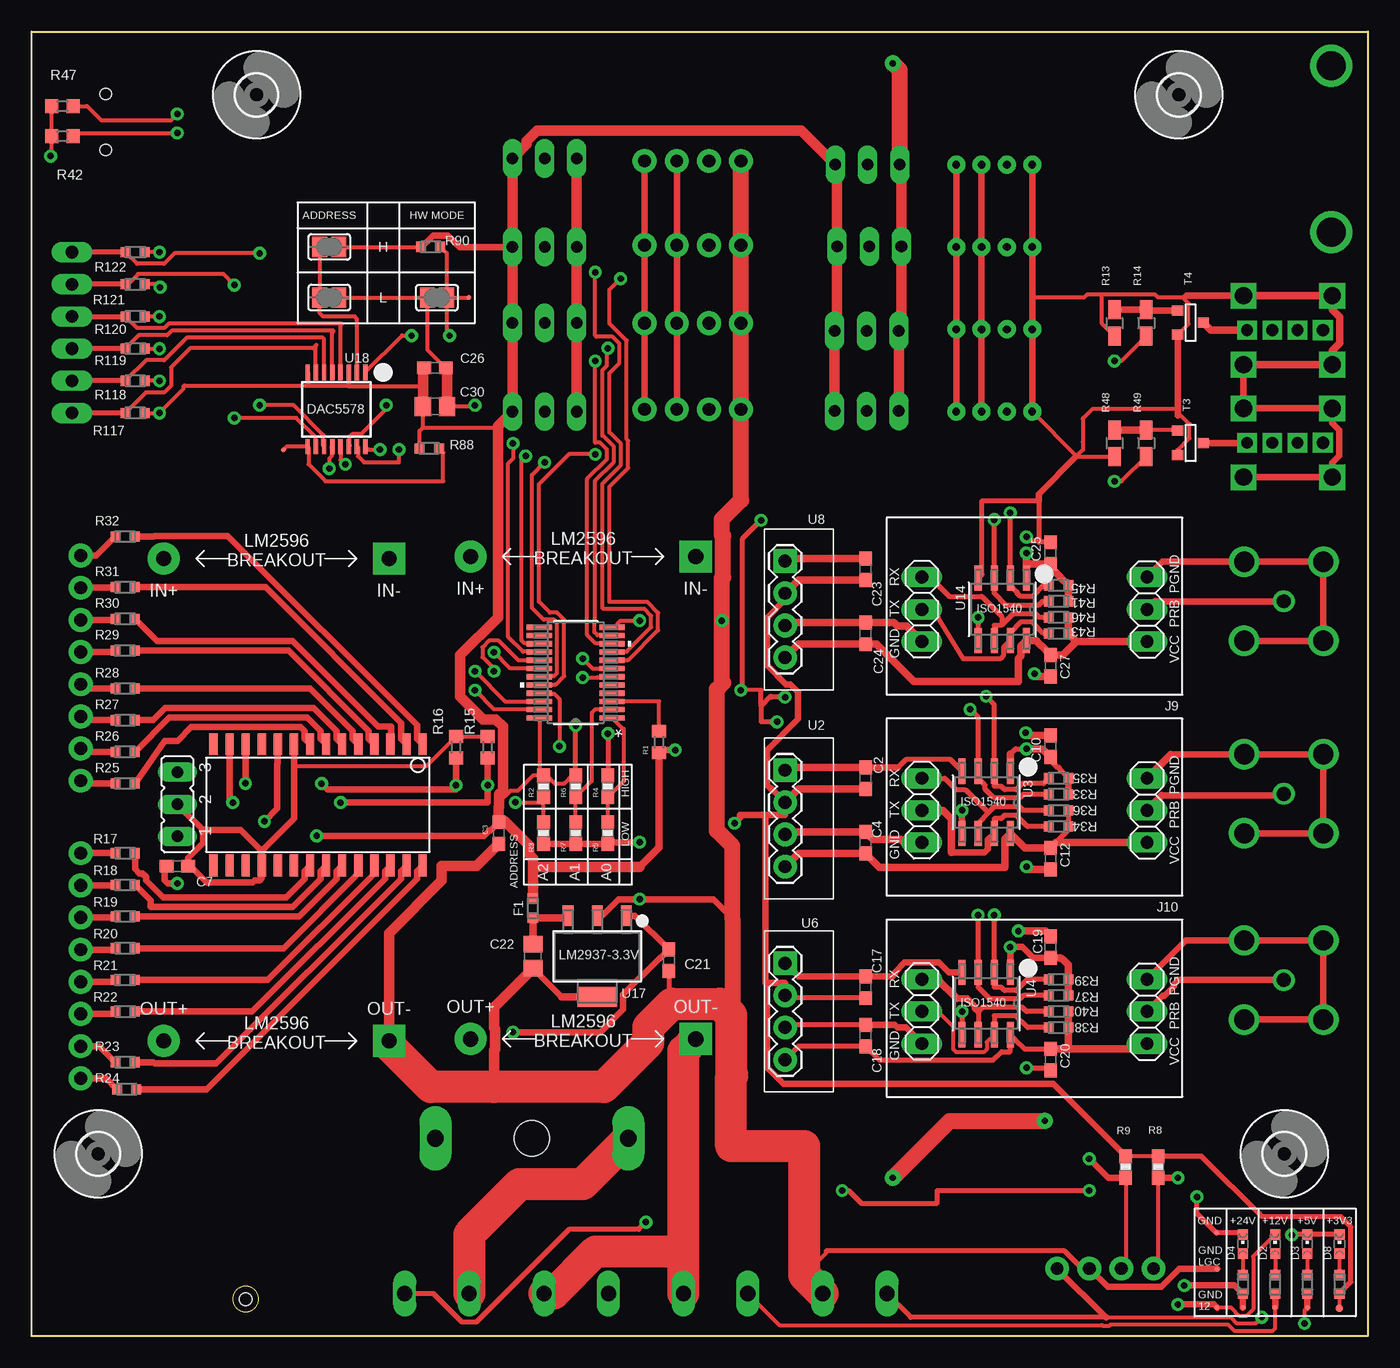
[diagram p5: board, top side]
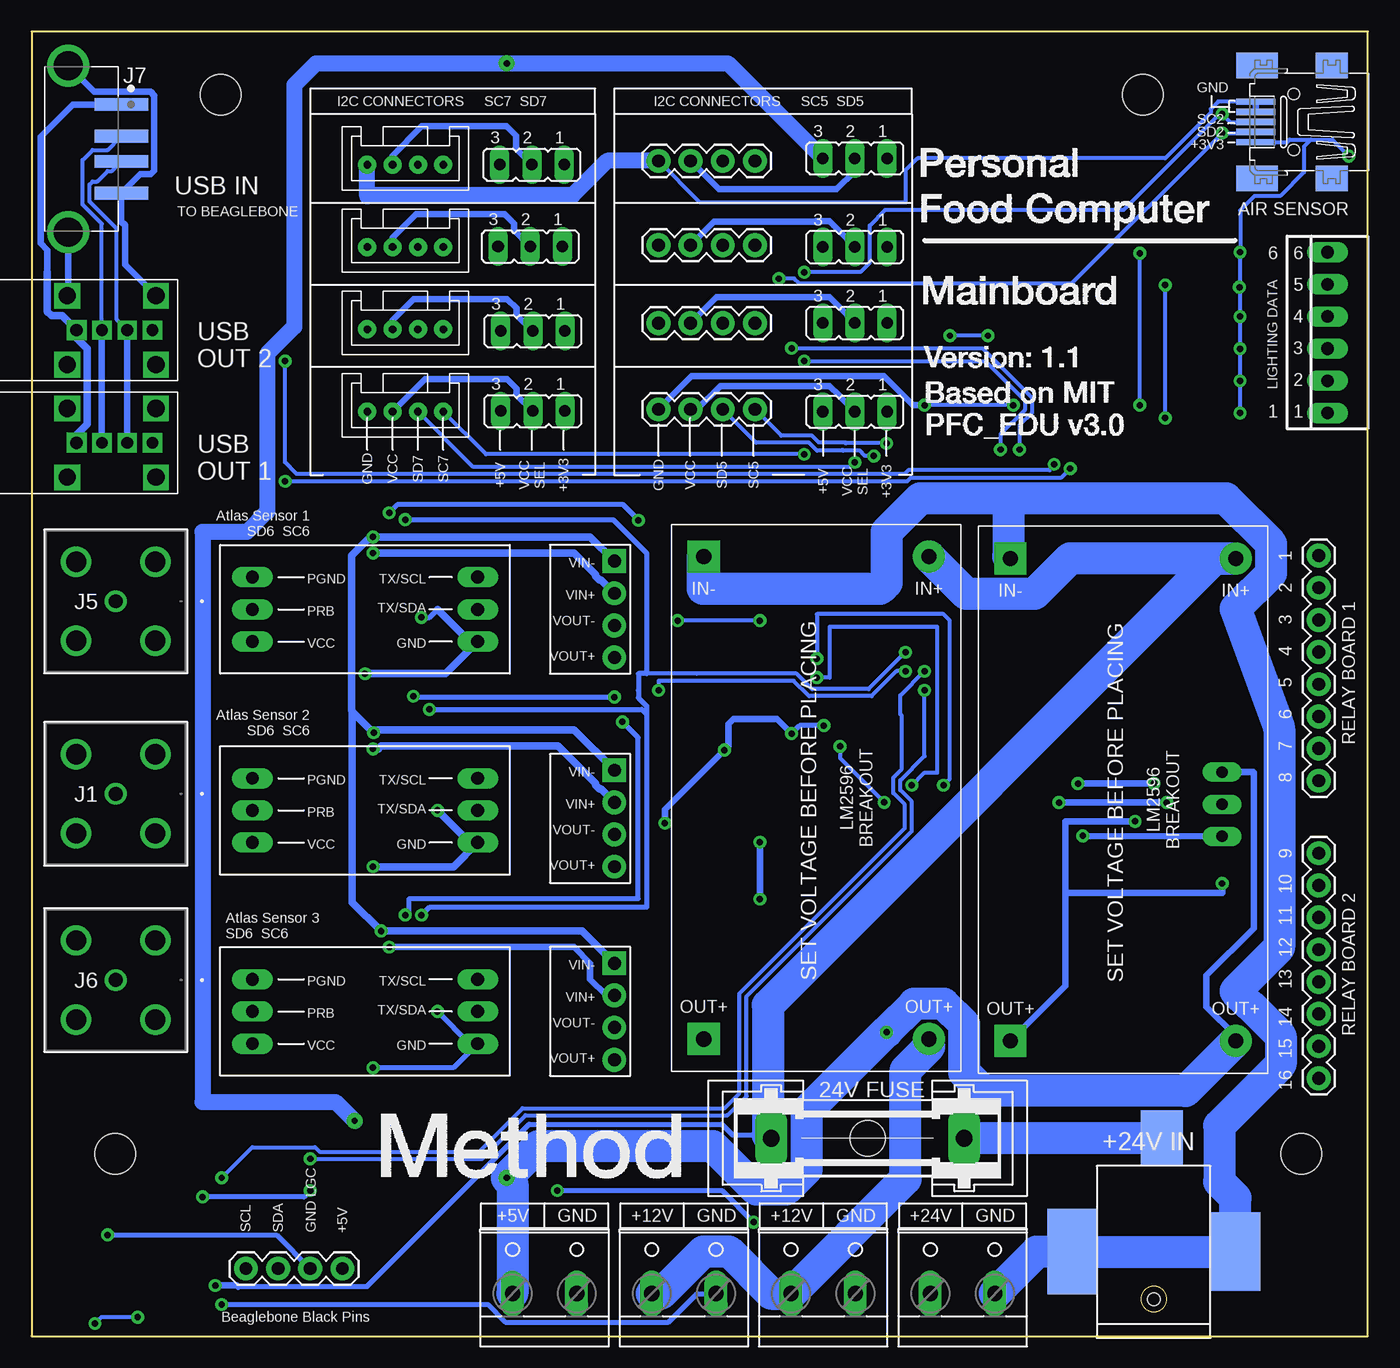
[diagram p6: board, bottom side, seen from below]

Size 105.5 x 103 mm. Coordinates in mm from the lower left corner, seen from the top.
Outline: 0,0 0,103 105.5,103 105.5,0 0,0
Copper layers (1*16): Top 0.035mm / dielectric 1.5mm / Bottom 0.035mm
Design rules "SparkFun": minimum track width 8mil, minimum drill 20mil, track to track 8mil, track to pad 8mil, pad to pad 8mil, via to via 8mil, smd to smd 8mil, copper to edge 8mil, drill to drill 8mil, minimum pad ring 12mil, minimum via ring 10mil, stop-mask expansion 4mil, vias tented up to drill 20mil, thermal gap 10mil
Holes 1 mm at 16.89,2.92

### Footprints (pad centres in the part's own frame; a part is rotated, then mirrored left to right if it is on the bottom)
C0603 = smd 1.1 x 1: 1 -0.85,0; 2 0.85,0
C0603@1 = smd 1.1 x 1: 1 -0.85,0; 2 0.85,0
C0805 = smd 1.3 x 1.5: 1 -0.95,0; 2 0.95,0
CHIPLED_0603 = smd 0.8 x 0.8: A 0,-0.75; C 0,0.75
0603 = smd 0.756 x 0.8: 1 -0.778,0; 2 0.778,0
GSH15 = drill 1.321 pad 2.54 long: 1 -7.62,0; 2 7.62,0 | hole 2.794: 0,0
SO28W = smd 0.65 x 1.7: 1 -7.62,-4.78; 2 -6.35,-4.78; 3 -5.08,-4.78; 4 -3.81,-4.78; 5 -2.54,-4.78; 6 -1.27,-4.78; 7 0,-4.78; 8 1.27,-4.78; 9 2.54,-4.78; 10 3.81,-4.78; 11 5.08,-4.78; 12 6.35,-4.78; 13 7.62,-4.78; 14 8.89,-4.78; 15 8.89,4.78; 16 7.62,4.78; 17 6.35,4.78; 18 5.08,4.78; 19 3.81,4.78; 20 2.54,4.78; 21 1.27,4.78; 22 0,4.78; 23 -1.27,4.78; 24 -2.54,4.78; 25 -3.81,4.78; 26 -5.08,4.78; 27 -6.35,4.78; 28 -7.62,4.78
CONN5_5-1634503-1 = drill 1.092 pad 1.6: 1 0,0 | drill 1.6 pad 2.108: 2 -3.124,3.124; 3 -3.124,-3.124; 4 3.124,-3.124; 5 3.124,3.124
GROVE_4PIN_CONNECTOR = drill 0.6 pad 1.422: P$1 0,0; P$2 2,0; P$3 4,0; P$4 6,0
CUI_UJ2-AV-1-SMT = smd 1 x 4.2: 1 0,0; 2 2.5,0; 3 4.5,0; 4 7,0 | drill 2.3: SH1 -3.07,-4.2; SH2 10.07,-4.2
ATLAS-STAMP = drill 1.016 long: 1 -8.89,2.54; 2 -8.89,0; 3 -8.89,-2.54; 4 8.89,-2.54; 5 8.89,0; 6 8.89,2.54
1X04 = drill 1.016 pad 1.88: 1 0,0; 2 2.54,0; 3 5.08,0; 4 7.62,0
1X08 = drill 1.016 pad 1.88: 1 0,0; 2 2.54,0; 3 5.08,0; 4 7.62,0; 5 10.16,0; 6 12.7,0; 7 15.24,0; 8 17.78,0
JP2 = drill 0.914 long: 1 -2.54,0; 2 0,0; 3 2.54,0
LM2596 = drill 1.2 pad 2.54: IN+ 2.54,-2.54; OUT+ 40.64,-2.54 | drill 1.2 pad 2.54 square: IN- 2.54,-20.32; OUT- 40.64,-20.32
R0603 = smd 1 x 1.1: 1 -0.85,0; 2 0.85,0
0603-RES = smd 1.1 x 1: 1 -0.85,0; 2 0.85,0
RC0603N = smd 0.756 x 0.8: 1 -0.778,0; 2 0.778,0
R0805W = smd 1.5 x 1: 1 -1.052,0; 2 1.052,0
SJ1 = smd 1.168 x 1.6: 1 -0.762,0; 2 0.762,0
SOT-23 = smd 0.787 x 0.889: 1 0.025,-1.016; 2 -0.94,1.016; 3 0.991,1.016
TP04R = smd 0.4 x 0.4: 1 0,0
TP06R = smd 0.6 x 0.6: TP 0,0
PW24-M = smd 1.981 x 0.406: 1 -2.87,3.575; 2 -2.87,2.925; 3 -2.87,2.275; 4 -2.87,1.625; 5 -2.87,0.975; 6 -2.87,0.325; 7 -2.87,-0.325; 8 -2.87,-0.975; 9 -2.87,-1.625; 10 -2.87,-2.275; 11 -2.87,-2.925; 12 -2.87,-3.575; 13 2.87,-3.575; 14 2.87,-2.925; 15 2.87,-2.275; 16 2.87,-1.625; 17 2.87,-0.975; 18 2.87,-0.325; 19 2.87,0.325; 20 2.87,0.975; 21 2.87,1.625; 22 2.87,2.275; 23 2.87,2.925; 24 2.87,3.575
RM3.33.3S-SIP4 = drill 1.016 pad 1.88 square: 1 0,0 | drill 1.016 pad 1.88: 2 2.54,0; 3 5.08,0; 4 7.62,0
D8 = smd 1.981 x 0.559: 1 -2.464,1.905; 2 -2.464,0.635; 3 -2.464,-0.635; 4 -2.464,-1.905; 5 2.464,-1.905; 6 2.464,-0.635; 7 2.464,0.635; 8 2.464,1.905
MP04A = smd 1.6 x 0.838: 1 -3.2,2.3; 2 -3.2,0; 3 -3.2,-2.3 | smd 1.6 x 3.099: 4 3.2,0
TSSOP16 = smd 0.35 x 1.2: 1 -2.275,-2.925; 2 -1.625,-2.925; 3 -0.975,-2.925; 4 -0.325,-2.925; 5 0.325,-2.925; 6 0.975,-2.925; 7 1.625,-2.925; 8 2.275,-2.925; 9 2.275,2.925; 10 1.625,2.925; 11 0.975,2.925; 12 0.325,2.925; 13 -0.325,2.925; 14 -0.975,2.925; 15 -1.625,2.925; 16 -2.275,2.925
3,2 = hole 3.2: 0,0
BARREL-JACK-PJ-036AH = smd 4.4 x 3.3: 1 2.2,-0.65 | smd 6.75 x 3.9: 2 -6.75,6.45 | smd 6.2 x 3.9: 3 -6.75,-6.45
USB_RIGHT = drill 1.35 square: GND1 -2.72,-0.73; GND2 2.72,-0.73; GND3 -2.72,6.27; GND4 2.72,6.27 | drill 0.96 square: PIN1 0,0 | drill 0.92 square: PIN2 0,2; PIN3 0,4; PIN4 0,6
32005-201 = smd 3.1 x 0.5: 1 3,1.6; 2 3,0.8; 3 3,0; 4 3,-0.8; 5 3,-1.6 | smd 2.5 x 2: M1 -3,-4.45; M2 -3,4.45 | smd 3.3 x 2: M3 2.9,4.45; M4 2.9,-4.45 | hole 0.9: 0,2.2; 0,-2.2
W237-132 = drill 1.194 long: 1 -2.54,-0.635; 2 2.54,-0.635
22-23-2061 = drill 1 long: 1 -6.35,0; 2 -3.81,0; 3 -1.27,0; 4 1.27,0; 5 3.81,0; 6 6.35,0

### Placement (x,y rotation side)
C2  65.84,44.05 90 top
C3  36.88,39.73 270 top
C4  65.84,38.97 90 top
C7  11.5,37.12 180 top
C10  80.45,46.59 90 top
C12  80.45,37.7 270 top
C17  65.84,27.54 90 top
C18  65.84,23.73 90 top
C19  80.45,30.72 90 top
C20  80.45,21.83 270 top
C21  50.31,29.68 270 top
C22  39.57,29.99 270 top
C23  65.84,60.56 90 top
C24  65.84,55.48 90 top
C25  80.45,61.83 90 top
C26  31.85,76.44 0 top
C27  80.45,52.94 270 top
C30  31.85,73.41 0 top
D2  98.18,7.27 0 top
D3  100.72,7.27 0 top
D4  95.64,7.27 0 top
D8  103.26,7.27 0 top
F1  39.57,33.8 90 top
F12  39.5,15.62 180 bottom
IC2  23.25,41.95 180 top
J1  98.86,42.82 0 bottom
J2  73,86 180 bottom
J3  73,92.5 180 bottom
J5  98.86,58.02 0 bottom
J6  98.86,28.12 0 bottom
J7  98.42,97.25 270 bottom
J8  79.18,57.39 0 top
J9  79.18,41.51 0 top
J10  79.18,25.64 0 top
J12  48.4,73.18 180 bottom
J13  48.4,79.97 180 bottom
J14  48.4,86.13 180 bottom
J15  48.4,92.79 180 bottom
J16  73,73 180 bottom
J17  73,79.5 180 bottom
J18  3.88,38.13 270 bottom
J19  3.88,61.63 270 bottom
J20  88.59,5.34 0 bottom
JP1  65.93,73.04 180 bottom
JP2  65.93,79.36 180 bottom
JP3  66.14,86.04 180 bottom
JP4  66,92.5 180 bottom
JP5  40.5,73 180 bottom
JP6  40.5,80 180 bottom
JP7  40.5,86 180 bottom
JP8  40.5,93 180 bottom
JP9  11.5,42 90 top
L1  7.9,63.95 270 bottom
L2  32.11,64.1 270 bottom
R1  49.54,46.91 270 top
R2  40.42,43.41 90 top
R3  40.42,39.73 90 top
R4  45.5,43.41 90 top
R5  45.5,39.73 90 top
R6  42.96,43.41 90 top
R7  42.96,39.73 90 top
R8  88.93,13.36 90 top
R9  86.39,13.36 90 top
R10  98.18,4.1 270 top
R11  100.72,4.1 270 top
R12  95.64,4.1 270 top
R13  85.5,80 270 top
R14  88,80 270 top
R15  36,46.5 90 top
R16  33.5,46.5 90 top
R17  7.38,38.13 0 top
R18  7.38,35.63 0 top
R19  7.38,33.13 0 top
R20  7.38,30.64 0 top
R21  7.38,28.14 0 top
R22  7.38,25.64 0 top
R23  7.38,21.64 0 top
R24  7.5,19.5 0 top
R25  7.38,43.63 180 top
R26  7.38,46.13 180 top
R27  7.38,48.63 180 top
R28  7.38,51.13 180 top
R29  7.38,54.13 180 top
R30  7.38,56.63 180 top
R31  7.38,59.13 180 top
R32  7.38,63.13 180 top
R33  81.08,42.78 0 top
R34  81.08,40.24 0 top
R35  81.08,44.05 0 top
R36  81.08,41.51 0 top
R37  81.08,26.91 0 top
R38  81.08,24.37 0 top
R39  81.08,28.18 0 top
R40  81.08,25.64 0 top
R41  81.08,58.02 0 top
R42  2.43,94.74 180 top
R43  81.08,55.48 0 top
R44  103.26,4.1 270 top
R45  81.08,59.29 0 top
R46  81.08,56.75 0 top
R47  2.43,97.12 180 top
R48  85.5,70.5 270 top
R49  88,70.5 270 top
R88  31.39,70.09 0 top
R90  31.5,86 0 top
R117  8.18,72.89 0 top
R118  8.18,75.43 0 top
R119  8.18,77.97 0 top
R120  8.18,80.51 0 top
R121  8.18,83.05 0 top
R122  8.18,85.59 0 top
SJ_A1  23.5,86 180 top
SJ_A2  23.5,82 180 top
SJ_A3  32,82 0 top
T3  91.5,70.5 90 top
T4  91.5,80 90 top
TP1  98.18,2.24 0 top
TP2  103.26,2.19 270 top
TP3  100.72,2.24 0 top
TP4  95.64,2.24 0 top
TP5  93.55,8.15 0 top
TP6  93.6,5.3 0 top
TP7  93.6,2.24 0 top
TP104  34.5,82 90 top
TP105  19.89,70 90 top
U1  42.96,52.39 180 top
U2  59.49,44.69 270 top
U3  75.37,42.15 270 top
U4  75.37,26.27 270 top
U6  59.49,29.45 270 top
U8  59.49,61.2 270 top
U14  76.64,57.39 270 top
U17  44.65,29.99 270 top
U18  24.07,73.17 180 top
U$1  [3,2]  17.76,98.01 0 top
U$2  [3,2]  90.58,98.01 0 top
U$3  16.91,13.43 90 bottom
U$5  101.96,79.43 270 bottom
U$6  101.96,70.54 270 bottom
U$7  [3,2]  5.26,14.4 0 top
U$8  [3,2]  98.91,14.4 0 top
X1  5.85,95.87 180 bottom
X2  54,4 0 bottom
X3  65,4 0 bottom
X4  3.19,79.24 90 bottom
X5  32,4 0 bottom
X8  43,4 0 bottom

### Tracks (layer width: path | path; a pad name or v marks a point on that pad's centre or on a via)
24V_IN
  Bottom 2.54: F12.1 31.87,15.63 U$3.1
!LDAC!  (via drill 0.51)
  Top 0.305: R90.2 32.76,85.52 SJ_A3.2 | SJ_A3.2 TP104.1 | SJ_A3.2 32.76,79.24 v33,79 | U18.1 29.24,79 v30,79
  Bottom 0.305: v30,79 v33,79
+3V3  (via drill 0.51)
  Top 0.305: 30.9,76.34 C26.1 | R44.2 TP2.TP | R117.2 v10.09,72.89 12,74.81 12,75 12.06,75.06 21.84,75.06 | v10.09,75.43 R118.2 | R119.2 v10.09,77.97 | v10.09,80.51 R120.2 | v10.14,82.82 9.9,83.05 R121.2 | v10.09,85.59 R122.2 | U1.24 40.09,44.59 R2.2 | R2.2 39.58,44.26 38.38,43.06 37.81,43.06 36.88,42.13 C3.1 | R2.2 40.69,44.26 41.3,43.65 42.06,43.65 42.66,44.26 R6.2 | R8.2 R9.2 | v1.5,93.18 1.58,93.27 R42.2 R47.2 | SJ_A1.1 R90.1 | 30.9,71.75 C30.1 | 30.9,71.75 30.61,71.46 R88.1 | U18.3 25.04,75.04 25,75 | 25,75 30.9,75 | U18.8 21.84,76.05 21.84,75.06 | 21.84,75.06 24.94,75.06 25,75 | 30.9,71.75 36.71,71.75 36.82,71.86
  Top 0.406: C17.1 59.71,26.69 U6.2 | 77.27,45.96 77.69,46.38 v78.54,46.38 | C10.1 80.45,45.47 81,44.91 81.14,44.91 81.14,44.77 R35.2 | R6.2 v42.96,48.21 | v45.5,47.57 R4.2 | R8.2 92.37,14.21 97.15,9.43 103.37,9.43 104.17,8.63 104.17,4.29 103.26,3.38
  Top 0.508: C19.1 79.09,29.87 78.24,30.72 v77.27,30.72 U4.1 | U6.2 59.49,27.9 57.94,27.9 | 57.94,41.16 59.49,41.16 U2.2 58.4,43.24 58.34,43.24 58.05,43.54 58.05,46.25 60.51,48.71 60.51,50.87 59.91,51.47 59.55,51.47 58.05,52.98 58.05,56.72 59.49,58.16 U8.2 | 57.94,27.9 57.94,41.16 | R1.2 49.75,46.27 v50.81,46.27 | R33.2 R35.2 | C3.1 36.23,39.94 36.16,39.94 35.73,39.5 v22.5,39.5 | R44.2 103.26,3.38 | 63.59,79.57 JP2.1 | 57.94,41.16 55.92,41.16 55.92,40.92 v55.5,40.5 | R9.2 80.68,19.92 59.35,19.92 58.05,21.23 58.05,27.8 57.94,27.9 | R90.1 30.78,86 31.69,86.91 32.87,86.91 33.77,86 JP7.1
  Top 0.61: R37.2 R39.2 81.86,29.3 81.41,29.76 81.23,29.87 C19.1 | U3.1 77.27,45.96 | C2.1 60.68,43.2 60.66,43.19 60.53,43.19 U2.2 | C23.1 60.68,59.71 60.66,59.7 60.53,59.7 U8.2 | R41.2 R45.2 81.24,59.91 81.24,59.92 80.91,60.25 80.9,60.25 80.45,60.7 C25.1 78.76,60.98 78.54,61.2 | 78.54,61.2 U14.1 | 78.54,61.2 v78.54,61.83 | C10.1 79.86,46.33 79.72,46.33 79.67,46.38 v78.54,46.38 | R1.2 49.54,38.58 48,37.04
  Top 0.813: C30.1 30.9,75 30.9,76.34 | F1.2 39.57,37.13 | 39.57,37.13 39.57,37.74 39.26,38.06 39.26,38.76 37.38,40.63 37.33,40.58 C3.1 36.88,41.73 36.91,41.77 36.91,42.76 37.21,43.06 37.21,48.12 36.65,48.69 35.66,48.69 33.83,50.52 33.83,53.77 36.82,56.76 36.82,71.86 JP5.1 JP6.1 JP7.1 JP8.1 39.08,94.12 39.08,94.35 39.91,95.18 60.78,95.18 JP4.1 63.59,92.36 JP3.1 63.59,79.57 | 48,37.04 39.67,37.04 39.57,37.13 | JP2.1 JP1.1
  Bottom 0.305: v10.09,72.89 v10.09,75.43 v10.09,77.97 v10.09,80.51 10.09,82.87 | 10.09,82.87 v10.14,82.82 | 10.09,82.87 v10.09,85.59 10.09,88.89 8.96,90.01 6.93,90.01 5.04,91.9 5.04,93.94 4.5,94.48 | X1.1 6.38,94.27 6.18,94.48 4.5,94.48 | 4.5,94.48 2.79,94.48 v1.5,93.18
  Bottom 0.406: v45.5,47.57 44.86,48.21 v42.96,48.21
  Bottom 0.508: v77.27,30.72 62.67,30.72 61.4,29.45 61.4,28.18 60.13,26.91 U6.2 | v45.5,47.57 46.66,48.74 50.09,48.74 50.48,48.35 50.48,46.6 v50.81,46.27 55.5,41.58 v55.5,40.5 | JP9.1 v22.5,39.5
  Bottom 0.61: U2.2 60.53,43.19 60.66,43.19 60.99,43.52 60.99,43.65 63.94,46.59 77.91,46.59 78.12,46.38 v78.54,46.38 | v78.54,61.83 62.67,61.83 60.99,60.16 60.99,60.03 60.66,59.7 60.53,59.7 U8.2
+5V  (via drill 0.51, 0.51 pad 1.27)
  Top 0.305: 84.82,1.48 94.68,1.48 95.13,1.02 96.65,1.02 v97.13,1.5 | TP3.1 100.5,2.02 v100.5,1
  Top 0.406: 84.82,1.48 69.42,1.48 X3.1
  Top 0.508: U17.1 47.64,33.2 C21.1 49.66,29.89 49.6,29.89 46.71,27 46.71,25.78 44.93,24 v38,24 | TP3.1 R11.2 | 84.84,1.5 84.82,1.48 J20.4 | JP8.3 JP7.3 43.04,85.5 JP6.3 | JP4.3 68.54,86.18 JP3.3 68.67,85.5 68.67,79.57 JP2.3
  Top 0.813: JP8.3 43.04,85.5 | JP7.3 JP6.3 JP5.3 | JP4.3 68.67,92.36 68.67,85.5 | JP3.3 68.67,79.57 | JP2.3 JP1.3
  Top 1.27: v68,12.5 72.5,17 v80,17 | JP4.3 68.54,99.96 v68,100.5
  Bottom 0.305: v97.13,1.5 100,1.5 v100.5,1
  Bottom 0.508: JP9.3 9.04,44.54 9,44.5 9,32.21 12.73,28.48 12.73,26 10.44,23.7 L1.OUT+
  Bottom 1.27: v80,17 81.5,18.5 92,18.5 92,63.5 88.5,63.5 86.9,65.1 86.9,77.58 84.77,79.7 84.77,98.77 83.05,100.5 v68,100.5 50.54,100.5 JP8.3
  Bottom 2.54: L1.OUT+ 14.39,19.35 30.39,19.35 31.86,20.82 31.86,24.62 33.5,26.25 35.81,26.25 38,24.07 | X3.1 67.54,12.04 v68,12.5 65.5,15 51.72,15 48.27,11.56 45.96,11.56 44.32,13.19 44.32,17.74 38,24.07 | v38,24 38,24.07
+12V
  Top 0.305: X2.1 59.03,0.87 84.5,0.87 84.55,0.82 85.09,0.82 85.19,0.92 94.45,0.92 94.94,0.43 98,0.43 98.18,0.61 TP1.1
  Top 0.508: TP1.1 R10.2
  Bottom 2.54: X2.1 55.79,3.37 52.47,6.69 50.45,6.69 47.13,3.37 X8.1 36.5,12.4 36.5,21 34.65,22.85 L2.OUT+
+24V  (via drill 0.51)
  Top 0.508: TP4.1 R12.2 94.96,4 v91,4
  Top 2.54: F12.2 43.5,12 38.5,12 34.54,8.04 X5.1
  Bottom 0.406: 89.3,4 89.23,4 89.17,3.94 79,3.94 66.22,16.73 51,16.73 50.16,15.88 47.38,15.88
  Bottom 0.508: v91,4 89.3,4 89.19,3.89
  Bottom 2.54: L2.IN+ 31.71,58.62 26.31,58.62 23.52,61.41 L1.IN+ 12.11,61.41 47.38,26.14 47.38,15.88 F12.2
A0_EXT_1
  Top 0.305: U1.1 46.7,47.95 46.77,47.95 46.77,43.83 R4.1 R5.2
A1_EXT_1
  Top 0.305: R7.2 R6.1 44.23,43.83 44.23,49.22 44.48,49.47 U1.2
A2_EXT_1  (via drill 0.51)
  Top 0.305: R2.1 R3.2 40.42,42.15 v38.19,42.15 | U1.21 40.13,50.73 41.24,50.73 41.68,50.29 v41.68,46.57
  Bottom 0.305: v41.68,46.57 41.68,45.64 v38.19,42.15
ADDR0
  Top 0.305: SJ_A1.2 SJ_A2.2 22.74,80.76 23,80.5 25.5,80.5 25.69,80.31 U18.2
D+
  Bottom 0.305: U$5.PIN2 99.96,87.83 101.48,89.35 101.48,92.86 100.68,93.66 99.51,93.66 J7.2
  Bottom 0.508: U$6.PIN2 U$5.PIN2
D-
  Bottom 0.305: U$5.PIN3 98.78,80.26 98.78,87.44 100.92,89.58 100.92,90.92 100.68,91.16 100.34,91.16 99.5,92 99.17,92 J7.3
  Bottom 0.508: U$5.PIN3 U$6.PIN3
DAC_!CLR!
  Top 0.305: U18.9 21.79,70 | U18.9 21.86,70.18 21.86,68.85 23.21,67.5 32.5,67.5 32.5,69.76 R88.2 | U18.9 20.14,70.25 TP105.1
GND  (via drill 0.51)
  Top 0.406: D4.C 95.51,8.15 TP5.1 92,9.7 v92,11 | v64,11.5 64.5,11.5 65.5,10.5 71.5,10.5 71.5,11.5 v83.5,11.5 | v48.5,9 47.92,8.42 42.42,8.42 35.1,1.1 33.98,1.1 31.72,3.37 X5.2
  Bottom 0.406: v83.5,11.5 84,11 v92,11 | v64,11.5 51,11.5 v48.5,9
  Bottom 2.54: 28.38,66.14 11.21,66.14 7.64,62.57 7.64,60.25 10.46,57.44 7,48 7,30.7 10.46,27.24 9.32,26.1 9.28,26.1 6.88,23.71 6.88,21.47 11.74,16.61 11.74,12.19 10.46,10.91 U$3.3 U$3.2 26.14,6.68 X5.2 | 28.38,66.14 28.38,61.57 L1.IN- | 28.38,66.14 35.37,66.14 38,63.5 38,59.5 38.5,59 52.5,59 52.5,61.49 L2.IN-
GND_(12V)  (via drill 0.51)
  Top 0.305: D2.C 96.45,6.29 96.45,2.12 95.91,1.58 95.37,1.58 94.7,2.25 TP7.1
  Top 0.508: v90.5,2.5 93.34,2.5 TP7.1
  Top 2.54: X2.2 51.46,7 | 51.46,7 51.46,22.49 L2.OUT- | X8.2 41.21,3.37 44.53,6.69 51.15,6.69 51.46,7
  Bottom 0.406: v90.5,2.5 69.5,2.5 68.1,1.1 55.22,1.1 52.96,3.37 X2.2
GND_LOGIC  (via drill 0.51)
  Top 0.305: SJ_A2.1 SJ_A3.1 31.24,77.91 C26.2 | 32.85,73.35 C30.2 34.91,73.41 v35,73.5 | J16.P$4 82.5,69.5 | 82.5,69.5 82.55,69.45 R48.2 | 90.5,72.68 90.75,72.68 91.41,72.03 91.41,70.9 90.48,69.98 T3.2 | 90.5,73.18 83.73,73.18 83.05,72.5 83,72.5 83,72.45 82.99,72.44 82.99,70.61 83,70.6 83,70 82.5,69.5 | 79,82 83.1,82 83.33,82.23 84.5,82.23 | 84.5,82.23 88.72,82.23 88.96,82 91,82 91,81.89 91.33,81.55 91.33,79.91 T4.2 | R13.2 84.5,79.95 84.5,82.23 | v28,73.5 28,73.21 26.05,71.26 25.35,71.26 25.11,71.02 25.11,70.32 U18.14 | U1.12 45.97,55.97 46.5,56.5 v48,56.5 | 62.73,6.73 62.73,6.56 61,4.83
  Top 0.406: C25.2 79.51,62.68 79.51,62.8 | 79.51,62.8 78.85,62.8 v78.54,63.1 | 79.51,62.8 79.51,65.97 75.04,65.97 75.04,60.16 U14.4 | 68.4,44.9 69.02,45.52 72.55,45.52 U3.4 | J20.3 82.94,5.33 81.55,6.73 62.73,6.73 | D8.C D3.C 99.52,8.02 v99.5,8 | C21.2 50.31,26.48 50.53,26.25
  Top 0.508: U6.1 60.55,28.39 C17.2 67.94,28.39 68.15,28.6 68.15,28.72 68.93,29.5 71.65,29.5 72.41,28.74 U4.4 | IC2.10 19.44,45.23 19.38,45.17 19.38,41.65 v18.38,40.65 | C22.2 41.83,26.79 | TP6.1 90.6,5.3 89.19,3.89 84.95,3.89 J20.3 | J16.P$4 J17.P$4 79,82 J2.P$4 J3.P$4 | J13.4 J14.4 56.02,86.5 J15.4 | C7.2 10.5,36.97 10.5,36 10.75,35.75 v11.5,35.75 | 79.51,65.97 79.51,66.51 82.5,69.5 | U$5.GND3 91.15,82.15 91,82 | U$6.GND4 U$6.GND2 102.69,68.98 103.25,69.55 103.25,71.53 102.69,72.1 U$6.GND1 U$6.GND3 U$5.GND4 | T4.2 90.5,79.04 90.5,73.18 90.5,72.68 | U17.2 45.02,33.2 46.33,34.5 47.58,34.5 47.59,34.5 v48,34.5 53.82,34.5 53.83,34.5 55.33,33 | C2.2 68.4,44.9 | R3.1 R7.1 R5.1 45.61,39 v48,39
  Top 0.61: 41.83,26.79 U17.4 | U$5.GND3 U$5.GND1 102.69,81.06 103.3,80.45 103.3,78.41 102.69,77.8 U$5.GND2 U$5.GND4 | C23.2 59.71,61.41 U8.1 | C19.2 80.03,31.99 v77.91,31.99 | C2.2 59.71,44.9 U2.1 | C10.2 78.49,47.44 v78.49,47.65
  Top 0.813: C26.2 32.8,76.34 C30.2 | C3.2 35.13,37.13 32.38,37.13 32.38,35.97 28.21,31.81 L1.OUT- | C22.2 36.5,25.97 36.5,24.34 36.58,24.26 36.58,22.66 36.5,22.58 36.5,19.68
  Top 1.27: 56.02,86.5 J13.4 J12.4 56.02,66.02 54.5,64.5 54.5,63.29 54.59,63.2 54.59,59.92 54.5,59.83 v54.5,56.5 54.5,51.68 54.6,51.58 54.1,51.08 54.1,39.92 55.33,38.7 55.33,33 55.33,25.46 55.23,25.36 | J14.4 J15.4
  Top 2.54: L1.OUT- 28.21,22.97 31.5,19.68 36.5,19.68 45.18,19.68 48.67,23.17 48.67,24.39 50.53,26.25 54.33,26.25 55.23,25.36 55.23,20.57 | X3.2 61,4.83 61,15 55.23,15 55.23,20.57 | 55.23,20.57 55.33,20.57 | 55.33,20.67 55.23,20.57
  Bottom 0.305: X1.5 11.82,97.47 12.41,96.88 12.41,96.59 16,93 35.55,93 36.5,92.05 36.5,89.5 52.72,89.5 J15.4 | v28,73.5 v35,73.5 | v48,56.5 v54.5,56.5
  Bottom 0.406: v99.5,8 86.17,8 J20.3
  Bottom 0.508: X1.4 X1.5 | v18.38,40.65 23.88,40.65 23.88,35 | 23.88,35 23.88,27.64 L1.OUT- | 23.88,35 11.5,35 v11.5,35.75 | U$5.GND3 98.12,84.59 98.12,87.72 98.42,88.01 J7.4 96.92,91.74 96.11,91.74 95.81,92.04 95.81,97.96 96.11,98.26 100.55,98.26 J7.SH1 | J7.SH2 102.62,82.22 U$5.GND1 | v35,73.5 35.9,73.5 38.2,75.79 53.4,75.79 J12.4 | v48,39 v48,34.5
  Bottom 0.61: U8.1 61.4,63.1 v78.54,63.1 78.75,62.9 78.98,62.9 80.24,61.64 80.24,49.4 80.18,49.33 | U2.1 62.67,47.86 78.28,47.86 v78.49,47.65 80.18,49.33 | U6.1 62.03,31.99 v77.91,31.99 80.18,34.26 80.18,49.33
  Bottom 1.27: J15.4 60.07,92.79 62.78,90.09 78.91,90.09 79,90 J3.P$4
I2C_VCC_1
  Bottom 0.508: JP1.2 67.2,74.31 67.2,74.83 67.94,75.58 74.42,75.58 J16.P$3
I2C_VCC_2
  Bottom 0.508: J17.P$3 77,80.22 75.33,81.9 67.94,81.9 67.2,81.15 67.2,80.63 JP2.2
I2C_VCC_3
  Bottom 0.508: J2.P$3 77,86.72 75.15,88.58 68.15,88.58 67.41,87.83 67.41,87.31 JP3.2
I2C_VCC_4
  Bottom 0.508: JP4.2 67.27,93.77 67.27,94.79 68.01,95.53 74.69,95.53 77,93.22 J3.P$3
I2C_VCC_5
  Bottom 0.508: J12.3 52.98,73.18 51.13,75.03 42.51,75.03 41.77,74.29 41.77,74.27 JP5.2
I2C_VCC_6
  Bottom 0.508: JP6.2 41.77,81.27 41.77,81.29 42.51,82.03 51.42,82.03 J13.3
I2C_VCC_7
  Bottom 0.508: JP7.2 41.77,87.27 41.77,87.29 42.51,88.03 43.57,88.03 43.6,88 51.61,88 J14.3
I2C_VCC_8
  Bottom 0.508: JP8.2 40.5,92 41.94,90.56 51.24,90.56 J15.3
ISO_3V3_2
  Top 0.406: R36.2 R34.2 81.86,39.97 C12.1
  Top 0.61: U2.4 60.55,38.12 C4.1 66.95,37.02 76.84,37.02 76.84,39.25 U3.8 78.4,38.55 C12.1 80.87,38.97 J9.4
ISO_3V3_3
  Top 0.406: U4.8 77.63,23.45 | 77.63,23.45 78.4,22.68 C20.1 | 77.63,23.45 77.27,23.1 77.27,22.46 76.57,22.46 75.91,21.8 66.92,21.8 C18.1 60.55,22.88 U6.4
  Top 0.61: J10.4 87.65,22.68 81.72,22.68 | 81.72,22.68 C20.1 | 81.72,22.68 81.86,22.82 R38.2 R40.2
ISO_3V3_4
  Top 0.61: J8.4 82.5,54.85 | U8.4 60.55,54.63 C24.1 66.69,54.63 69.65,51.67 77.91,51.67 77.91,53.5 78.11,53.7 78.11,54.49 U14.8 79.32,54.92 79.37,54.87 79.37,54.85 79.7,54.52 79.72,54.52 C27.1 81.44,53.79 82.5,54.85 | 82.5,54.85 R43.2 R46.2
ISO_GND_2  (via drill 0.51)
  Top 0.508: U3.5 v73.46,41.51
  Top 0.61: J9.3 68.88,38.97 68.62,39.23 66.43,39.23 C4.2 59.71,39.82 U2.3 | C12.2 78.76,36.85 v78.54,37.07
  Bottom 0.61: v78.54,37.07 72.19,37.07 J9.3 70.92,38.97 v73.46,41.51
ISO_GND_3  (via drill 0.51)
  Top 0.406: v73.46,25.64 U4.5 | v78.54,21.19 80.23,21.19 C20.2 | C18.2 59.71,24.58 U6.3
  Top 0.508: C18.2 68.15,24.58 68.36,24.37 69.02,24.37 J10.3
  Bottom 0.406: v73.46,25.64 70.92,23.1 J10.3 72.19,21.19 v78.54,21.19
ISO_GND_4  (via drill 0.51)
  Top 0.406: U14.5 v74.73,56.75
  Top 0.61: J8.3 69.07,56.07 68.34,56.07 68.08,56.33 C24.2 59.71,56.33 U8.3 | C27.2 79.39,52.09 v79.18,52.31
  Bottom 0.406: v74.73,56.75 74.1,56.75 73.46,57.39
  Bottom 0.61: v79.18,52.31 72.83,52.31 J8.3 70.92,54.85 73.46,57.39
ISO_SCL_2
  Top 0.406: R36.1 78.29,41.51 78.02,41.79 75.98,41.79 75.54,41.34 | U3.6 74.73,40.54 75.54,41.34 | 75.54,41.34 73.72,43.16 72.99,43.16 72.11,44.05 J9.1
ISO_SCL_3
  Top 0.406: R40.1 78.54,25.64 78.21,25.97 75.06,25.97 74.73,25.64 U4.6
  Top 0.508: 73.04,26.65 73.88,26.65 74.48,26.06 74.48,25.89 74.73,25.64
  Top 0.61: 73.04,26.65 71.52,28.18 J10.1
ISO_SCL_4
  Top 0.406: R46.1 79.56,56.75 79.28,57.03 77.46,57.03 76.59,56.16 | 76.59,56.16 76.55,56.12 76,56.12 U14.6 | J8.1 70.92,59.93 72.45,58.4 75.01,58.4 76.59,56.82 76.59,56.16
ISO_SDA_2
  Top 0.406: R34.1 78.63,40.24 77.74,41.13 76.8,41.13 76.55,40.88 76,40.88 U3.7
  Top 0.508: U3.7 75.52,39.2 75.52,38.48 75.22,38.18 72.62,38.18
  Top 0.61: J9.2 71.95,41.51 72.62,40.84 72.62,38.18
ISO_SDA_3
  Top 0.305: U4.7 75.42,23.22 75.42,22.65 75.18,22.41 73.02,22.41 72.78,22.65 72.78,24.42 71.56,25.64 J10.2
  Top 0.406: R38.1 78.63,24.37 77.69,25.31 76,25.31 U4.7
ISO_SDA_4
  Top 0.406: J8.2 70.92,56.75 71.56,56.75 73.56,53.48 76.47,53.48 76.74,53.74 76.74,54.39 U14.7 77.27,55.57 78.07,56.37 79.01,56.37 79.9,55.48 R43.1
N$1
  Top 0.508: R13.1 R14.1 88.06,80.99 T4.3
N$2
  Top 0.305: D3.A R11.1
N$3
  Top 0.305: T3.3 90.42,71.55 R49.1
  Top 0.61: R49.1 R48.1
N$4
  Top 0.305: D4.A R12.1
N$5
  Top 0.508: T3.1 95.94,70.53 U$6.PIN4
N$6
  Top 0.508: IC2.21 21.54,36.73 21.54,36.11 20.09,34.66 10.38,34.66 9.04,35.99 9.04,36.24 8.75,36.54 8.5,36.54 8.16,36.88 R17.2
N$7
  Top 0.508: IC2.22 22.81,36.73 22.81,36.11 20.6,33.9 9.38,33.9 9.38,34.41 R18.2
N$8
  Top 0.61: T4.1 93.11,79.43 U$5.PIN4
N$9
  Top 0.508: IC2.23 24.08,36.73 24.08,36.11 21.11,33.13 R19.2
N$10
  Top 0.508: R20.2 19.88,30.64 25.79,36.54 IC2.24
N$11
  Top 0.508: R21.2 18.65,28.14 27.06,36.54 IC2.25
N$12
  Top 0.305: D2.A R10.1
N$13
  Top 0.508: IC2.26 27.89,36.73 27.89,36.11 17.42,25.64 R22.2
N$14
  Top 0.508: R23.2 9.6,21.64 9.7,21.53 14.59,21.53 29.16,36.11 29.16,36.73 IC2.27
N$15
  Top 0.508: IC2.28 30.43,36.73 30.43,36.11 13.83,19.5 R24.2
N$16
  Top 0.508: J18.1 R17.1
N$17
  Top 0.508: J18.2 6.56,35.59 R18.1
N$18
  Top 0.508: J18.3 6.52,33.05 R19.1
N$19
  Top 0.508: J18.4 6.48,30.52 R20.1
N$20
  Top 0.508: J18.5 6.44,27.98 R21.1
N$21
  Top 0.508: J18.6 6.4,25.43 R22.1
N$22
  Top 0.508: J18.7 5.34,22.89 R23.1
N$23
  Top 0.508: J18.8 5.87,20.36 R24.1
N$24
  Top 0.508: R25.2 4.1,43.63 J19.8
N$25
  Top 0.508: R26.2 4.14,46.13 J19.7
N$26
  Top 0.508: R27.2 4.18,48.63 J19.6
N$27
  Top 0.508: R28.2 4.22,51.13 J19.5
N$28
  Top 0.508: R29.2 6.48,54.02 J19.4
N$29
  Top 0.508: R30.2 6.52,56.55 J19.3
N$30
  Top 0.508: R31.2 6.56,59.09 J19.2
N$31
  Top 0.508: R32.2 5.1,61.63 J19.1
N$32
  Top 0.508: IC2.8 21.54,47.16 21.54,47.79 21.25,48.09 12.61,48.09 11.52,47 10.5,47 R25.1
N$33
  Top 0.508: IC2.7 22.81,47.16 22.81,47.79 21.75,48.85 10.87,48.85 R26.1
N$34
  Top 0.508: R27.1 9.58,48.63 10.56,49.61 22.26,49.61 24.08,47.79 24.08,47.16 IC2.6
N$35
  Top 0.508: IC2.5 25.35,47.16 25.35,47.79 22.01,51.13 R28.1
N$36
  Top 0.508: IC2.4 26.62,47.16 26.62,47.79 20.28,54.13 R29.1
N$37
  Top 0.508: R30.1 9.9,54.9 20.59,54.9 27.35,48.13 28.38,48.13 28.38,46.78 IC2.3
N$38
  Top 0.508: IC2.2 29.16,47.16 29.16,48.43 18.46,59.13 R31.1
N$39
  Top 0.508: IC2.1 30.43,47.16 30.43,48.24 15.48,63.19 9.7,63.19 9.65,63.13 R32.1
N$179
  Top 0.305: D8.A R44.1
N$180
  Top 0.61: U17.3 42.19,33.03 F1.1 C22.1
PGND_2
  Top 0.508: 89.96,45.95 J1.5 J1.2 J1.3 J1.4
  Top 0.61: J9.6 89.96,45.95
PGND_3
  Top 0.508: J10.6 91.14,31.25 J6.5 J6.2 J6.3 J6.4
PGND_4
  Top 0.508: J5.4 J5.3 J5.2 J5.5 89.29,61.15 J8.6
PRB_2
  Top 0.508: J1.1 98.72,42.68 89.24,42.68
  Top 0.61: 89.24,42.68 J9.5
PRB_3
  Top 0.508: J6.1 90.55,28.12 90.2,27.77 90.2,27.63 89.43,26.86 89.29,26.86 J10.5
PRB_4
  Top 0.508: J5.1 88.7,58.02
  Top 0.61: 88.7,58.02 J8.5
RESET1
  Top 0.305: R1.1 49.54,50.12 U1.3
SC1  (via drill 0.51)
  Top 0.305: v43.5,53.5 44.28,52.72 U1.7
  Top 0.508: IC2.12 16.9,43.67 v16.88,43.65 | v22.88,43.63 23.37,43.15 23.96,43.15 33.5,43.15 v33.5,43.5 R16.1
  Bottom 0.305: v33.5,43.5 33,44 33,56.5 33.5,57 43.5,57 v43.5,53.5
  Bottom 0.508: v16.88,43.65 16.9,43.63 v22.88,43.63
SC2  (via drill 0.51)
  Top 0.305: R47.1 4.38,97.12 5.5,96 11,96 v11.5,96.5 | U1.9 45.87,54.06 46.98,54.06 48.91,55.99 48.91,56.88 48.38,57.41 45.14,57.41 45.06,57.5 45.06,67.31 46.53,68.78 46.53,70.47 45.62,71.38 45.62,76.03 46.41,76.83 46.41,78.38 45.88,78.91 44.59,78.91 44.5,79 v44.5,84
  Bottom 0.305: X1.3 10.87,95.87 v11.5,96.5 11.71,96.5 19.27,88.94 38.09,88.94 39.33,87.7 39.33,84.75 40.02,84.07 44.43,84.07 v44.5,84
SC3  (via drill 0.51)
  Top 0.305: U1.11 45.78,55.36 44.67,55.36 44.43,55.59 44.43,56.34 44.5,56.41 44.5,67.54 45.97,69.02 45.97,70.24 45.11,71.1 45.06,71.1 45.06,76.27 45.41,76.62 45.41,77.91 v45.5,78 | U18.16 26.59,70 v27.5,70
  Bottom 0.305: v27.5,70 27.5,71.92 26.53,72.89 26.53,74.11 30.42,78 v45.5,78
SC5  (via drill 0.51)
  Top 0.305: U1.16 40.05,54.06 38.79,54.06 37.63,55.21 37.63,68.91 38,69.28 v38,70.5
  Top 0.508: J12.1 J13.1 J14.1 J15.1
  Bottom 0.305: v38,70.5 41.21,70.5 41.27,70.56 43.35,70.56 43.89,71.1 46.32,71.1 J12.1
SC6  (via drill 0.51)
  Top 0.305: U1.18 37.78,52.72 v36.5,54
  Top 0.406: R37.1 78.29,26.91 78.02,26.63 75.65,26.63 74.73,27.54 U4.3 74.73,33.23 v74.72,33.24 | R33.1 78.29,42.78 78.02,42.5 75.98,42.5 75.27,43.22 75.27,43.52 74.73,44.05 U3.3 74.73,48.85 v74.1,49.49 | R41.1 79.81,58.02 79.48,57.69 76.97,57.69 76,58.66 U14.3 v76,64.47
  Bottom 0.305: 56.95,52.31 53,52.31 45.1,52.31 43.88,51.09 39.41,51.09 v36.5,54
  Bottom 0.406: v74.72,33.24 74.07,33.89 56.95,33.89 56.95,49.13 | v74.1,49.49 57.31,49.49 56.95,49.13 | v76,64.47 59.59,64.47 56.95,61.83 56.95,52.31 57.59,52.31 57.59,51 57.59,50.4 56.95,49.77 56.95,49.13
SC7  (via drill 0.51)
  Top 0.305: U1.20 40.13,51.46 41.38,51.46 42.04,52.11 42.04,56.57 41.48,57.13 40.92,57.13 40.06,58 40.06,67.27 42.42,69.63 v44.5,69.63
  Top 0.508: J16.P$1 J17.P$1 J2.P$1 J3.P$1
  Bottom 0.305: v44.5,69.63 69.63,69.63 J16.P$1
SCL  (via drill 0.51)
  Top 0.305: R8.1 88.93,5.68 J20.1 | v35,52.5 37.38,50.12 U1.22
  Top 0.508: R8.1 v90.5,12.5
  Bottom 0.305: v90.5,12.5 88.09,14.91 83.12,14.91 82.77,14.56 70.18,14.56 66.74,18 50.79,18 49.62,19.17 49.62,27.06 36.56,40.12 36.56,41.98 37.47,42.89 37.47,44.11 36.79,44.79 36.79,49 36.91,49.12 36.91,50.59 v35,52.5
SD1  (via drill 0.51)
  Top 0.305: v43.5,52 44.64,52 44.67,52.03 45.78,52.03 U1.6
  Top 0.508: IC2.13 15.63,42.39 v15.88,42.13 | v24.38,42.13 35.98,42.13 36,42.15 v36,43.5 R15.1
  Bottom 0.305: v36,43.5 35,44.5 34,44.5 34,56 42.5,56 42.5,52 v43.5,52
  Bottom 0.508: v15.88,42.13 v24.38,42.13
SD2  (via drill 0.51)
  Top 0.305: R42.1 3.54,95 v11.5,95 | U1.8 45.87,53.41 47.12,53.41 49.47,55.76 49.47,57.11 48.61,57.97 45.64,57.97 45.62,58 45.62,67.08 47.09,68.55 47.09,70.7 46.97,70.82 46.97,78.61 45.62,79.97 45.62,82.62 v46.5,83.5
  Bottom 0.305: X1.2 8.92,95 v11.5,95 23.41,83.09 44.88,83.09 45.29,83.5 v46.5,83.5
SD3  (via drill 0.51)
  Top 0.305: U18.15 25.76,70.18 25.76,69.48 26.24,69 29,69 v29,70 | U1.10 45.78,54.71 44.53,54.71 43.87,55.36 43.87,67.7 45.41,69.25 45.41,70.01 44.88,70.54 44.5,70.54 v44.5,77
  Bottom 0.305: v29,70 29,71.21 27.09,73.12 27.09,73.88 30.21,77 v44.5,77
SD5  (via drill 0.51)
  Top 0.305: U1.15 40.05,54.71 38.93,54.71 38.69,54.95 38.69,69.19 v39,69.5
  Top 0.508: J12.2 J13.2 J14.2 J15.2
  Bottom 0.305: v39,69.5 39.71,69.5 40.12,69.91 41.41,69.91 | 41.41,69.91 41.5,70 | 41.41,69.91 43.49,69.91 44.12,70.54 48.3,70.54 J12.2
SD6  (via drill 0.51)
  Top 0.305: U1.17 38.43,53.37 36.88,54.91 36.12,54.91 35.59,54.38 35.59,53.62 36.5,52.71 v36.5,52.5 | 56.09,51 v56,51 57.59,51
  Top 0.406: R39.1 78.63,28.18 77.74,27.29 76.8,27.29 76.55,27.54 76,27.54 U4.2 v76,33.26 | R35.1 79.89,43.64 78.22,43.64 77.74,43.16 76.8,43.16 76.55,43.42 76,43.42 U3.2 76,49.89 v75.37,50.53 | 57.59,49.77 58.35,50.53 58.43,50.45 v59.49,50.45 | 57.59,49.77 57.59,48.5 v58.86,48.5 | R45.1 79.9,59.29 79.01,58.4 78.07,58.4 77.81,58.67 77.81,58.76 77.27,59.29 U14.2 v77.27,65.01 | v57.59,64.42 56.09,62.92 56.09,51 | 57.59,49.77 57.59,51
  Bottom 0.305: v36.5,52.5 37.21,52.5 39.18,50.53 44.11,50.53 45.33,51.75 56,51.75 v56,51
  Bottom 0.406: v76,33.26 75.69,33.26 75.69,34.55 57.61,34.55 57.61,47.25 v58.86,48.5 | v57.59,64.42 58.81,65.64 76.64,65.64 v77.27,65.01 | v75.37,50.53 75.29,50.45 v59.49,50.45
SD7  (via drill 0.51)
  Top 0.305: U1.19 40.13,52.11 41.24,52.11 41.48,52.34 41.48,56.34 41.24,56.58 40.42,56.58 39.5,57.5 39.5,68 v40.5,69
  Top 0.508: J16.P$2 J17.P$2 J2.P$2 J3.P$2
  Bottom 0.305: v40.5,69 40.86,68.64 70.64,68.64 J16.P$2
SDA  (via drill 0.51)
  Top 0.305: R9.1 86.39,5.68 J20.2 | U1.23 40.05,49.5 36.5,49.5 v35,51
  Top 0.508: R9.1 85.01,12.51 85,12.5 v83.5,14
  Bottom 0.305: v83.5,14 69.95,14 66.51,17.44 50.56,17.44 49.06,18.94 49.06,26.83 36,39.89 36,42.21 36.91,43.12 36.91,43.88 35,45.79 v35,51
USB1  (via drill 0.51)
  Top 0.305: R49.2 86.05,67.5 v85.5,67.5 | U18.12 23.67,70.18 23.67,69.48 23.5,69.31 v23.5,68.5
  Bottom 0.305: v85.5,67.5 36.37,67.5 36.06,67.81 24.19,67.81 v23.5,68.5
USB2  (via drill 0.51)
  Top 0.305: R14.2 86.05,77 v85.5,77 | U18.13 24.39,69.21 v24.77,68.83
  Bottom 0.305: v24.77,68.83 24.77,68.73 25.13,68.37 36.29,68.37 36.58,68.08 84.58,68.08 85.5,69 v85.5,77
V+
  Bottom 0.508: 104.26,84.03 104.26,85.76 104.78,86.28 104.78,94.72 102.25,97.25 J7.1 | U$6.PIN1 101.96,71.17
  Bottom 0.61: 104.26,84.03 104.26,80.91 103.93,80.58 103.11,80.58 U$5.PIN1 101.96,78.8 101.11,77.95 101.11,72.02 101.96,71.17
VCC_IN_MCP
  Top 0.305: R15.2 R16.2 31.15,45 20.71,45
  Top 0.508: 13.53,39.99 13.53,38.93 12.35,37.75 C7.1 12.51,37.12 13.82,35.81 17.44,35.81 17.63,36 18,36 18.17,36.17 IC2.18 18.17,38.33 | 13.53,39.99 12.79,40.73 12.77,40.73 JP9.2 | 13.53,39.99 16.51,39.99 18.17,38.33 | 18.17,38.33 20.71,40.87 20.71,45 IC2.9
VSET
  Top 0.305: U18.7 22.44,78.21 | 22.44,78.21 22.5,78.27 | 22.44,78.21 22.23,78 12.5,78 11,76.5 11,75.05 10.46,74.52 9.02,74.52 7.4,72.9 R117.1
  Top 0.406: R117.1 X4.1
VSET_2
  Top 0.305: U18.6 23.09,78.73 23,78.82 12.23,78.82 10.46,77.06 9.03,77.06 R118.1
  Top 0.406: R118.1 X4.2
VSET_3
  Top 0.305: U18.5 23.74,79.24 23.83,79.33 23.83,79.38 11.04,79.38 10.7,79.04 8.47,79.04 R119.1
  Top 0.406: R119.1 X4.3
VSET_4
  Top 0.305: U18.4 24.39,79.89 24.44,79.94 | 24.44,79.94 24.5,79.94 | 24.44,79.94 10.81,79.94 10.46,79.6 8.32,79.6 R120.1
  Top 0.406: X4.4 R120.1
VSET_5  (via drill 0.51)
  Top 0.305: U18.10 22.42,70.27 22.42,70.97 20.89,72.5 v16,72.5 | R121.1 7.61,83.05 8.41,83.86 15.14,83.86 v16,83
  Top 0.406: R121.1 X4.5
  Bottom 0.305: v16,72.5 v16,83
VSET_6  (via drill 0.51)
  Top 0.305: U18.11 23.02,70.32 23.02,71.16 20.68,73.5 v18,73.5 | v18,85.5 11.29,85.5 10.46,84.68 8.32,84.68 R122.1
  Top 0.406: R122.1 X4.6
  Bottom 0.305: v18,73.5 v18,85.5

### Text on the board
tPlace: ADDRESS | HW MODE | H | L | HIGH | ADDRESS | LOW | A2 | A1 | A0 | GND | +24V | +12V | +5V | +3V3 | GND / LGC | GND / 12
bPlace: GND | I2C CONNECTORS SC5 SD5 | I2C CONNECTORS SC7 SD7 | SC2 | SD2 | +3V3 | USB IN | AIR SENSOR | TO BEAGLEBONE | 6 | 6 | 5 | 4 | USB / OUT 2 | 3 | 2 | LIGHTING DATA | 1 | 1 | USB / OUT 1 | +3V3 | VCC / SEL | +5V | SC5 | SD5 | VCC | GND | +3V3 | VCC / SEL | +5V | SC7 | SD7 | VCC | GND | Atlas Sensor 1 / SD6 SC6 | 1 | 2 | RELAY BOARD 1 | 3 | 4 | 5 | 6 | Atlas Sensor 2 / SD6 SC6 | 7 | 8 | 9 | 10 | RELAY BOARD 2 | 11 | 12 | Atlas Sensor 3 / SD6 SC6 | 13 | 14 | 15 | 16 | 24V FUSE | +24V IN | GND | +24V | GND | +12V | GND | +12V | GND | +5V | +5V | GND LGC | SDA | SCL | Beaglebone Black Pins
tNames: C21
tValues: 12V | 5V | TCA9548APWR